# Altium project MSM8916_DRAM_PMIC_REF.PrjPcb (part 1 of 4)
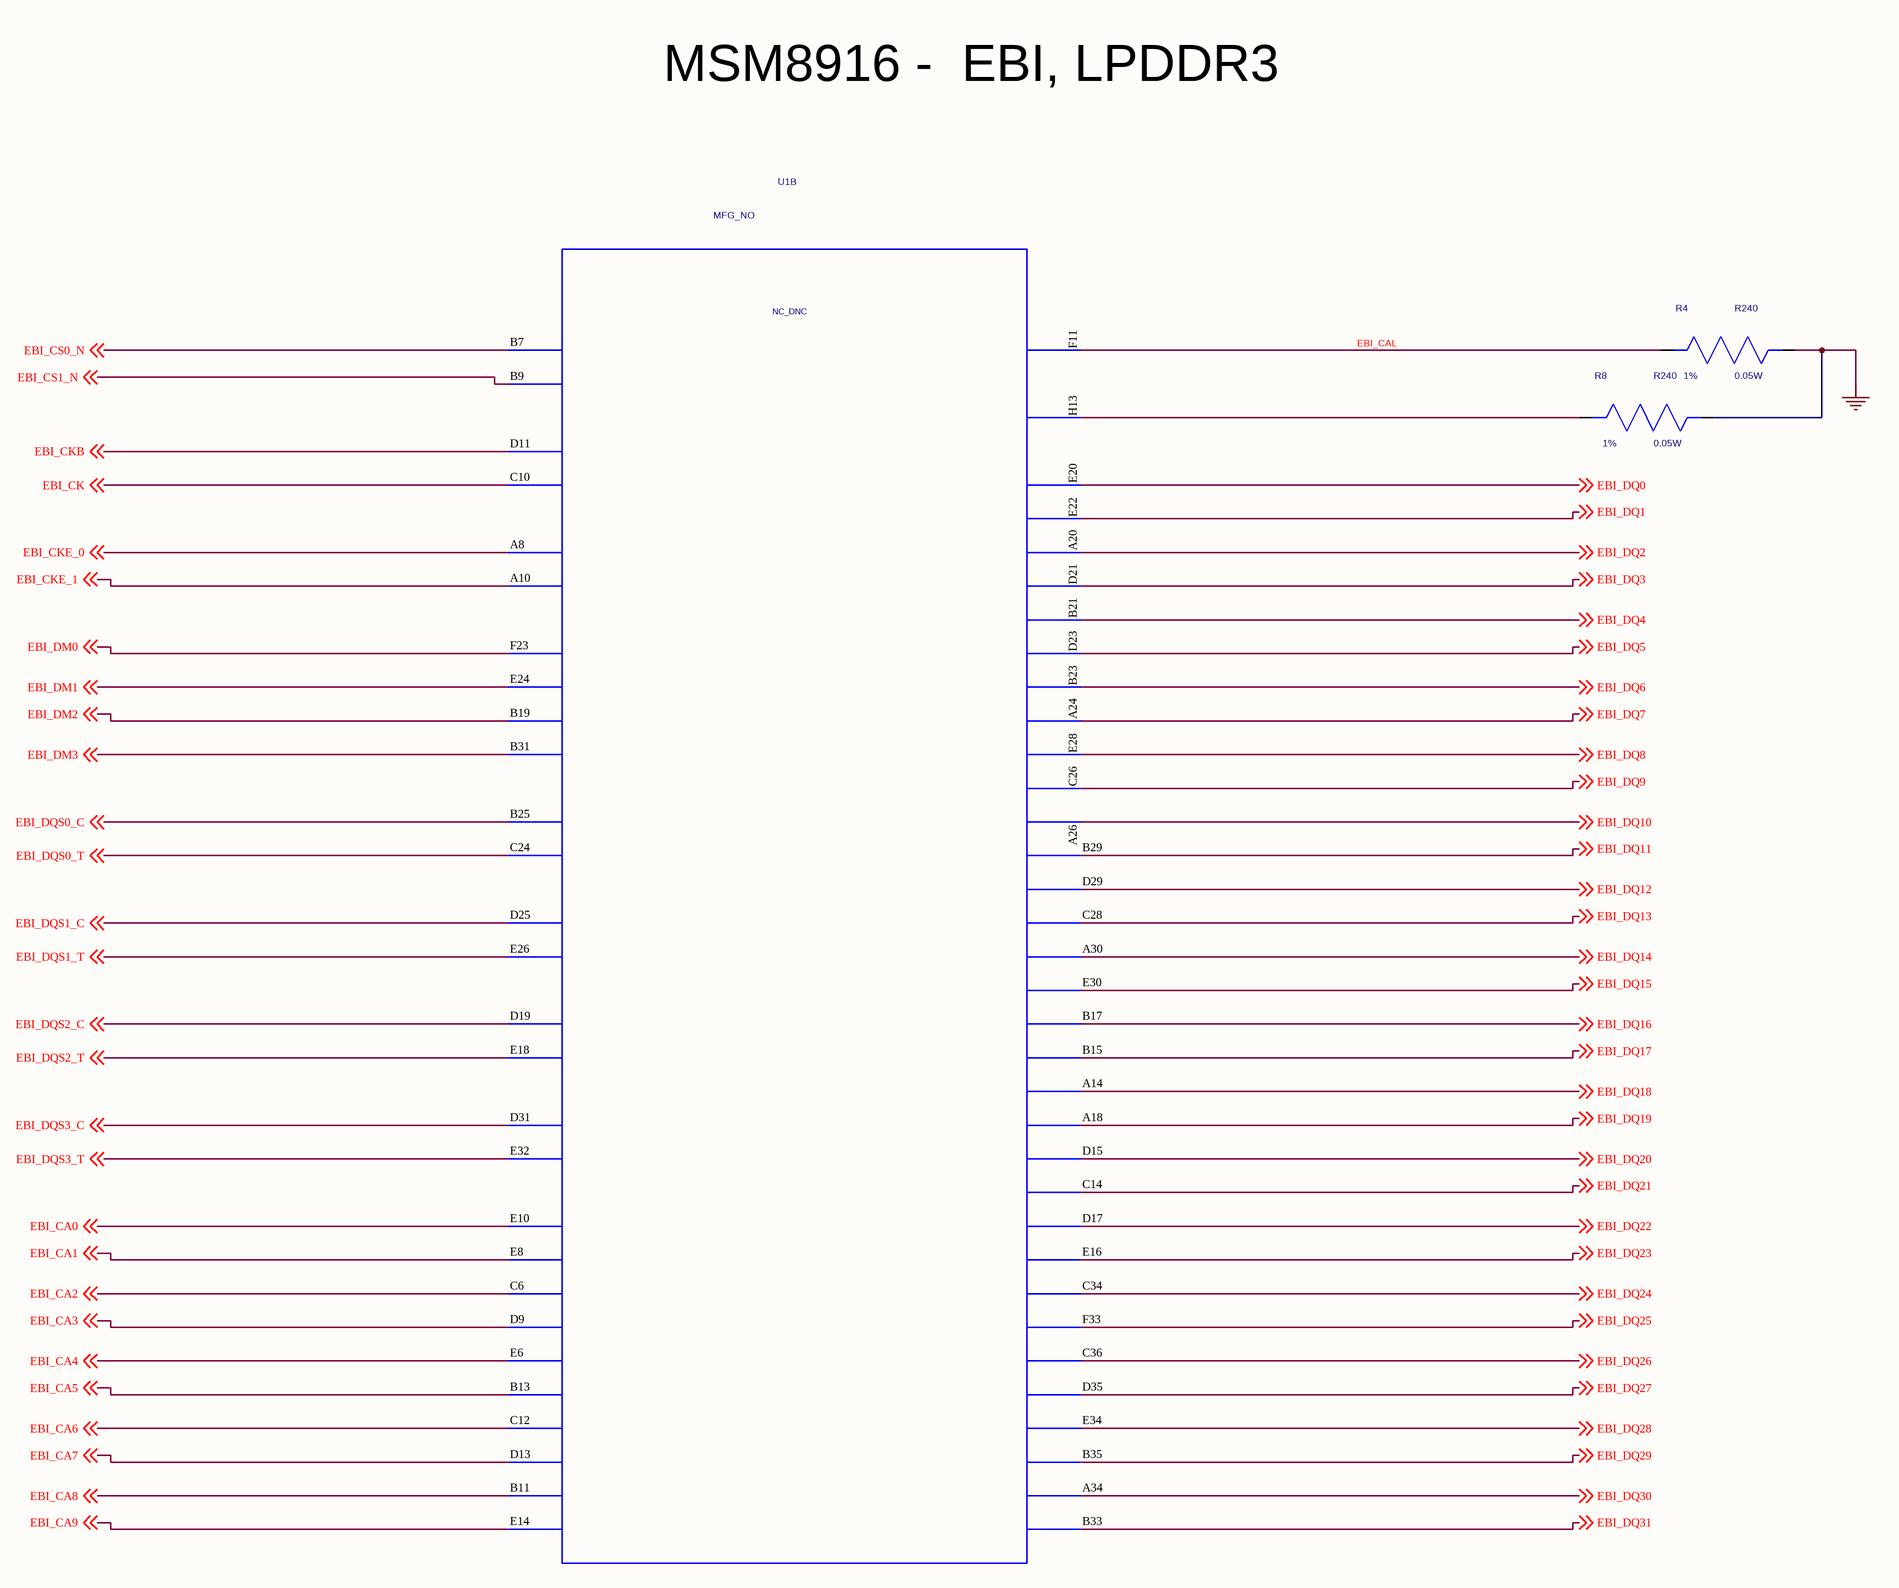
[diagram p0: 06_MSM8916_EBIO LPDDR3.SchDoc, top left]
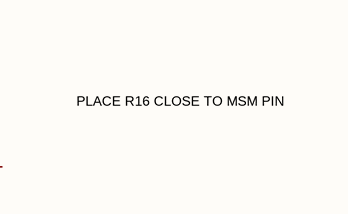
[diagram p1: 06_MSM8916_EBIO LPDDR3.SchDoc, top right]
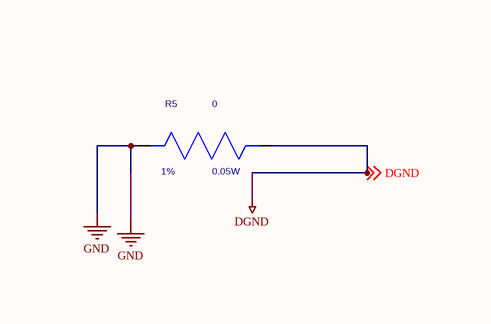
[diagram p2: 06_MSM8916_EBIO LPDDR3.SchDoc, bottom left]
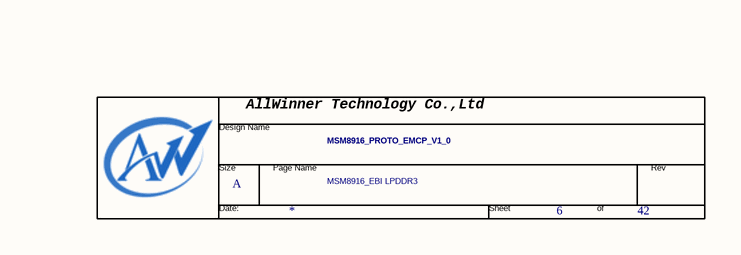
[diagram p3: 06_MSM8916_EBIO LPDDR3.SchDoc, bottom right]
17 sheets, 227 parts. Net scope: global (net labels, ports and power ports of the same name join across sheets).
Board file: MSM8916_board.PcbDoc
Sheets:
  06_MSM8916_EBIO LPDDR3.SchDoc
  05 MSM8916_CONTROL.SchDoc
  07_MSM8916_GPIO.SchDoc
  08_MSM8916_RF.SchDoc
  09_MSM8916_MIPI.SchDoc
  11 MSM8916_POWER2.SchDoc
  10 MSM8916_POWER1.SchDoc
  12 MSM8916_POWER3.SchDoc
  21 MEMORY_POWER.SchDoc
  14 PM8916_CONTROL CLOCK.SchDoc
  15 PM8916_CHARGING GPIO.SchDoc
  16 PM8916_SMPS.SchDoc
  17 PM8916_LDO.SchDoc
  20 MEMORY_CONTROL.SchDoc
  BYPASS_CAP.SchDoc
  SD Card_WCN_RF.SchDoc
  INTERFACE_PWR_LS_HS.SchDoc

## Sheet 06_MSM8916_EBIO LPDDR3.SchDoc
size 868 x 576 mm

### Parts
(Parts that share a designator on the sheet are numbered #1, #2 ... from top to bottom, then left to right.)
*#1  Page Count: 42  Page Number: 6  Page Size: A  Title: MSM8916_PROTO_EMCP_V1_0  Doc: MSM8916_EBI LPDDR3  (hidden comment: TitleBlock0-AW)  (graphical)
R4  R240  Tolerance: 1%  POWER: 0.05W  [c0402]
R5  0  Tolerance: 1%  POWER: 0.05W  [c0402]
R8  R240  Tolerance: 1%  POWER: 0.05W  [c0402]
U1  SYMNAME: NC_DNC  PART_ID: MFG_NO  [MSM-8916-0-760NSP-TR-00-0]  (hidden comment: ASIC_MSM8936_760PIN)  (part B of 13)

### Nets
DGND: R5.2(NEG) ; off-sheet DGND
GND: R4.2(NEG) R5.1(POS) R8.2(NEG)
EBI_CA0: U1.E10(EBI0_CA_0) ; off-sheet EBI_CA0
EBI_CA1: U1.E8(EBI0_CA_1) ; off-sheet EBI_CA1
EBI_CA2: U1.C6(EBI0_CA_2) ; off-sheet EBI_CA2
EBI_CA3: U1.D9(EBI0_CA_3) ; off-sheet EBI_CA3
EBI_CA4: U1.E6(EBI0_CA_4) ; off-sheet EBI_CA4
EBI_CA5: U1.B13(EBI0_CA_5) ; off-sheet EBI_CA5
EBI_CA6: U1.C12(EBI0_CA_6) ; off-sheet EBI_CA6
EBI_CA7: U1.D13(EBI0_CA_7) ; off-sheet EBI_CA7
EBI_CA8: U1.B11(EBI0_CA_8) ; off-sheet EBI_CA8
EBI_CA9: U1.E14(EBI0_CA_9) ; off-sheet EBI_CA9
EBI_CAL: R4.1(POS) U1.F11(EBI0_CAL)
EBI_CK: U1.C10(EBI0_CK) ; off-sheet EBI_CK
EBI_CKB: U1.D11(EBI0_CKB) ; off-sheet EBI_CKB
EBI_CKE_0: U1.A8(EBI0_CKE_0) ; off-sheet EBI_CKE_0
EBI_CKE_1: U1.A10(EBI0_CKE_1) ; off-sheet EBI_CKE_1
EBI_CS0_N: U1.B7(EBI0_CS_N_0) ; off-sheet EBI_CS0_N
EBI_CS1_N: U1.B9(EBI0_CS_N_1) ; off-sheet EBI_CS1_N
EBI_DM0: U1.F23(EBI0_DM_0) ; off-sheet EBI_DM0
EBI_DM1: U1.E24(EBI0_DM_1) ; off-sheet EBI_DM1
EBI_DM2: U1.B19(EBI0_DM_2) ; off-sheet EBI_DM2
EBI_DM3: U1.B31(EBI0_DM_3) ; off-sheet EBI_DM3
EBI_DQ0: U1.E20(EBI0_DQ_0) ; off-sheet EBI_DQ0
EBI_DQ1: U1.E22(EBI0_DQ_1) ; off-sheet EBI_DQ1
EBI_DQ2: U1.A20(EBI0_DQ_2) ; off-sheet EBI_DQ2
EBI_DQ3: U1.D21(EBI0_DQ_3) ; off-sheet EBI_DQ3
EBI_DQ4: U1.B21(EBI0_DQ_4) ; off-sheet EBI_DQ4
EBI_DQ5: U1.D23(EBI0_DQ_5) ; off-sheet EBI_DQ5
EBI_DQ6: U1.B23(EBI0_DQ_6) ; off-sheet EBI_DQ6
EBI_DQ7: U1.A24(EBI0_DQ_7) ; off-sheet EBI_DQ7
EBI_DQ8: U1.E28(EBI0_DQ_8) ; off-sheet EBI_DQ8
EBI_DQ9: U1.C26(EBI0_DQ_9) ; off-sheet EBI_DQ9
EBI_DQ10: U1.A26(EBI0_DQ_10) ; off-sheet EBI_DQ10
EBI_DQ11: U1.B29(EBI0_DQ_11) ; off-sheet EBI_DQ11
EBI_DQ12: U1.D29(EBI0_DQ_12) ; off-sheet EBI_DQ12
EBI_DQ13: U1.C28(EBI0_DQ_13) ; off-sheet EBI_DQ13
EBI_DQ14: U1.A30(EBI0_DQ_14) ; off-sheet EBI_DQ14
EBI_DQ15: U1.E30(EBI0_DQ_15) ; off-sheet EBI_DQ15
EBI_DQ16: U1.B17(EBI0_DQ_16) ; off-sheet EBI_DQ16
EBI_DQ17: U1.B15(EBI0_DQ_17) ; off-sheet EBI_DQ17
EBI_DQ18: U1.A14(EBI0_DQ_18) ; off-sheet EBI_DQ18
EBI_DQ19: U1.A18(EBI0_DQ_19) ; off-sheet EBI_DQ19
EBI_DQ20: U1.D15(EBI0_DQ_20) ; off-sheet EBI_DQ20
EBI_DQ21: U1.C14(EBI0_DQ_21) ; off-sheet EBI_DQ21
EBI_DQ22: U1.D17(EBI0_DQ_22) ; off-sheet EBI_DQ22
EBI_DQ23: U1.E16(EBI0_DQ_23) ; off-sheet EBI_DQ23
EBI_DQ24: U1.C34(EBI0_DQ_24) ; off-sheet EBI_DQ24
EBI_DQ25: U1.F33(EBI0_DQ_25) ; off-sheet EBI_DQ25
EBI_DQ26: U1.C36(EBI0_DQ_26) ; off-sheet EBI_DQ26
EBI_DQ27: U1.D35(EBI0_DQ_27) ; off-sheet EBI_DQ27
EBI_DQ28: U1.E34(EBI0_DQ_28) ; off-sheet EBI_DQ28
EBI_DQ29: U1.B35(EBI0_DQ_29) ; off-sheet EBI_DQ29
EBI_DQ30: U1.A34(EBI0_DQ_30) ; off-sheet EBI_DQ30
EBI_DQ31: U1.B33(EBI0_DQ_31) ; off-sheet EBI_DQ31
EBI_DQS0_C: U1.B25(EBI0_DQSB_0) ; off-sheet EBI_DQS0_C
EBI_DQS0_T: U1.C24(EBI0_DQS_0) ; off-sheet EBI_DQS0_T
EBI_DQS1_C: U1.D25(EBI0_DQSB_1) ; off-sheet EBI_DQS1_C
EBI_DQS1_T: U1.E26(EBI0_DQS_1) ; off-sheet EBI_DQS1_T
EBI_DQS2_C: U1.D19(EBI0_DQSB_2) ; off-sheet EBI_DQS2_C
EBI_DQS2_T: U1.E18(EBI0_DQS_2) ; off-sheet EBI_DQS2_T
EBI_DQS3_C: U1.D31(EBI0_DQSB_3) ; off-sheet EBI_DQS3_C
EBI_DQS3_T: U1.E32(EBI0_DQS_3) ; off-sheet EBI_DQS3_T
NetR8_1: R8.1(POS) U1.H13(EBI0_ODT)

### Notes on the sheet
- MSM8916 -  EBI, LPDDR3
- PLACE R16 CLOSE TO MSM PIN
- (in symbol TitleBlock0-AW) AllWinner Technology Co.,Ltd; Design Name; Size; Page Name; Rev; Date:; Sheet; of

### Library data of the parts
R4 R5 R8 = RESISTOR_Dup3: PART_NUMBER: MCN_NO; PART_ID: MFG_NO; OriginalSymbolOrigin: (-200,50); CDS_LMAN_SYM_OUTLINE: -150,50,150,-50; SYMNAME: resistor; PACK_TYPE: ?
U1 = ASIC_MSM8936_760PIN: PART_NUMBER: MCN_NO; OriginalSymbolOrigin: (-1100,2500); SPLIT_INST: TRUE; CDS_LMAN_SYM_OUTLINE: -1050,2500,1050,-2500; CDS_LMAN_SPLIT_NUMBER: 1 of 13; PACK_TYPE: ?
*#1 = TitleBlock0-AW: RevCode: ?; Page Create Date: March  8, 1995; Page Modify Date: *

## Sheet 05 MSM8916_CONTROL.SchDoc
size 868 x 576 mm
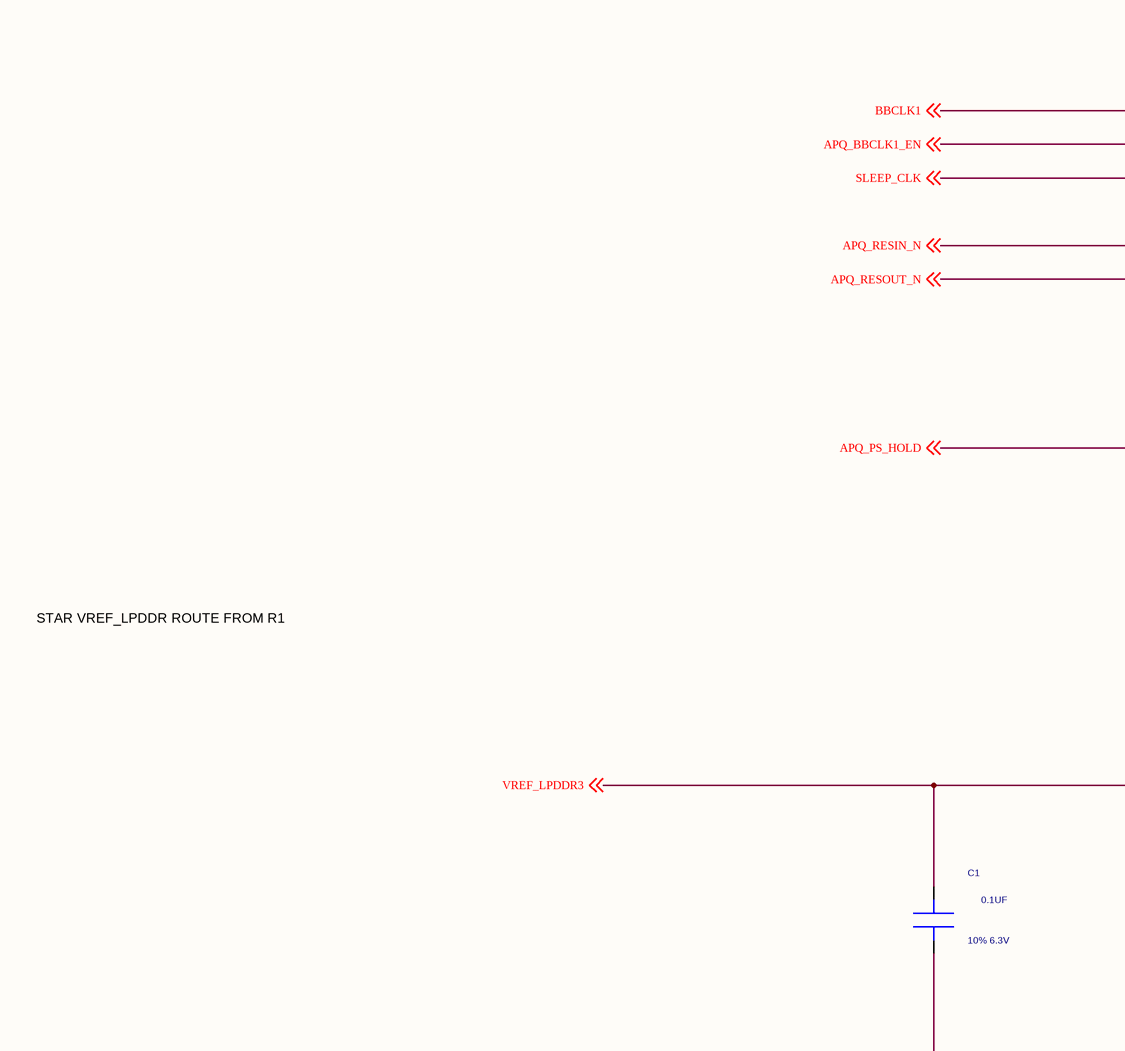
[diagram p4: 05 MSM8916_CONTROL.SchDoc, top left]
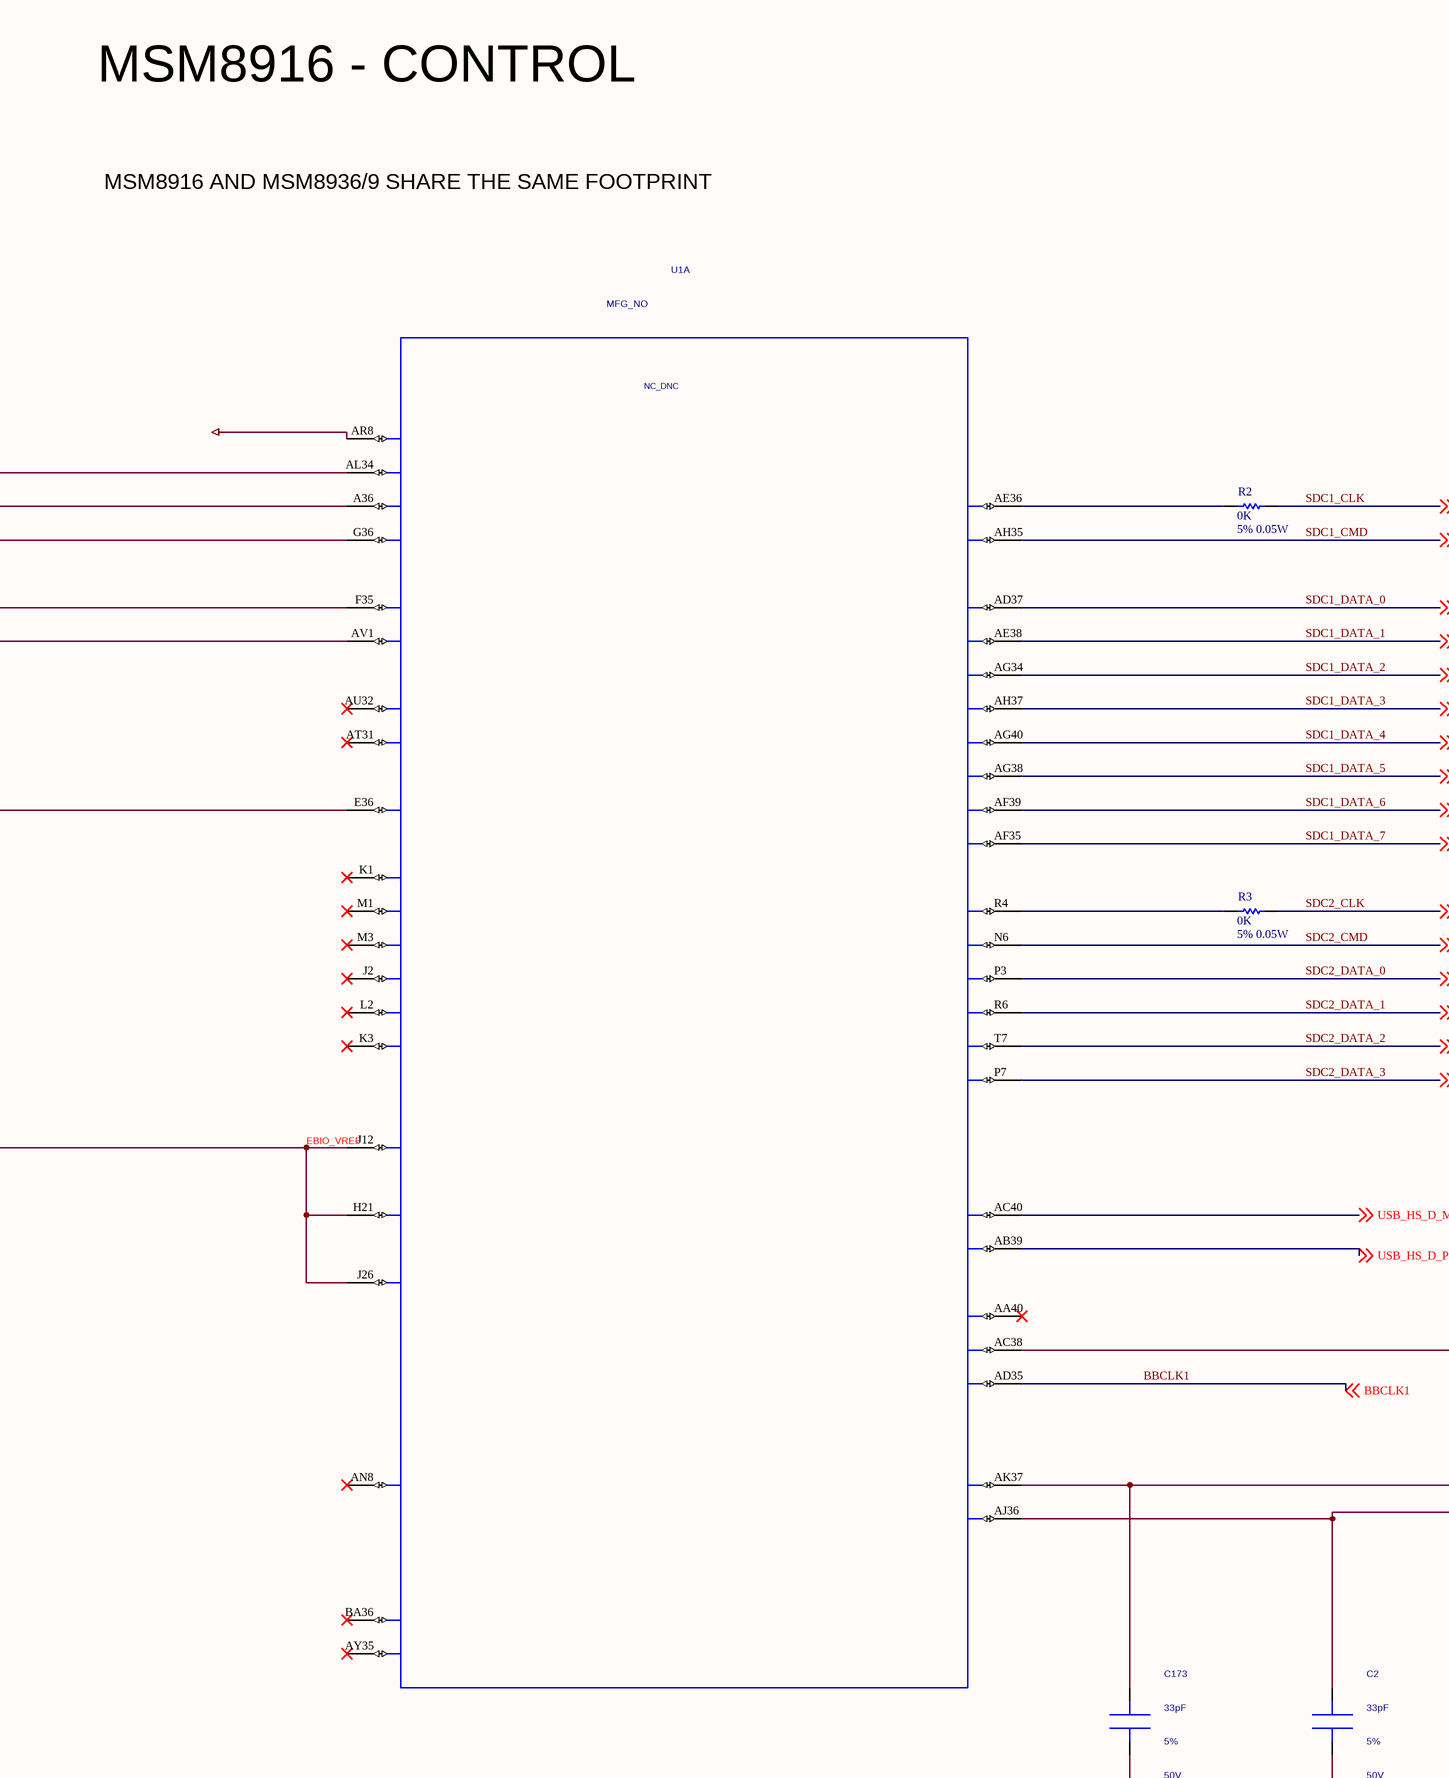
[diagram p5: 05 MSM8916_CONTROL.SchDoc, top middle]
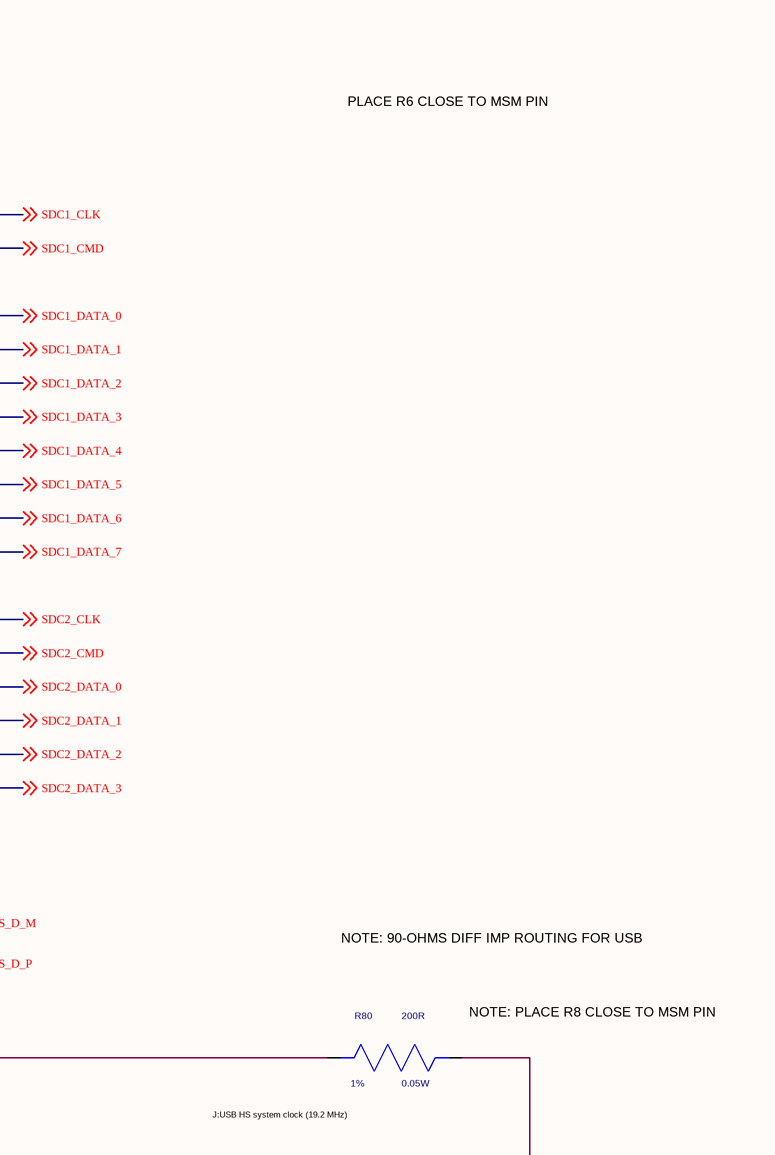
[diagram p6: 05 MSM8916_CONTROL.SchDoc, top right]
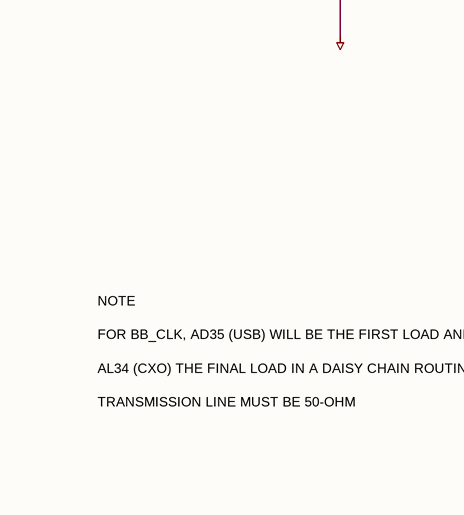
[diagram p7: 05 MSM8916_CONTROL.SchDoc, bottom left]
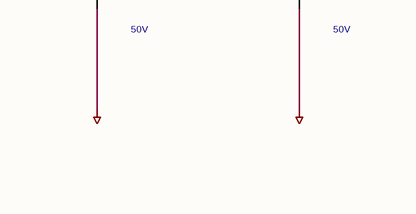
[diagram p8: 05 MSM8916_CONTROL.SchDoc, bottom middle]
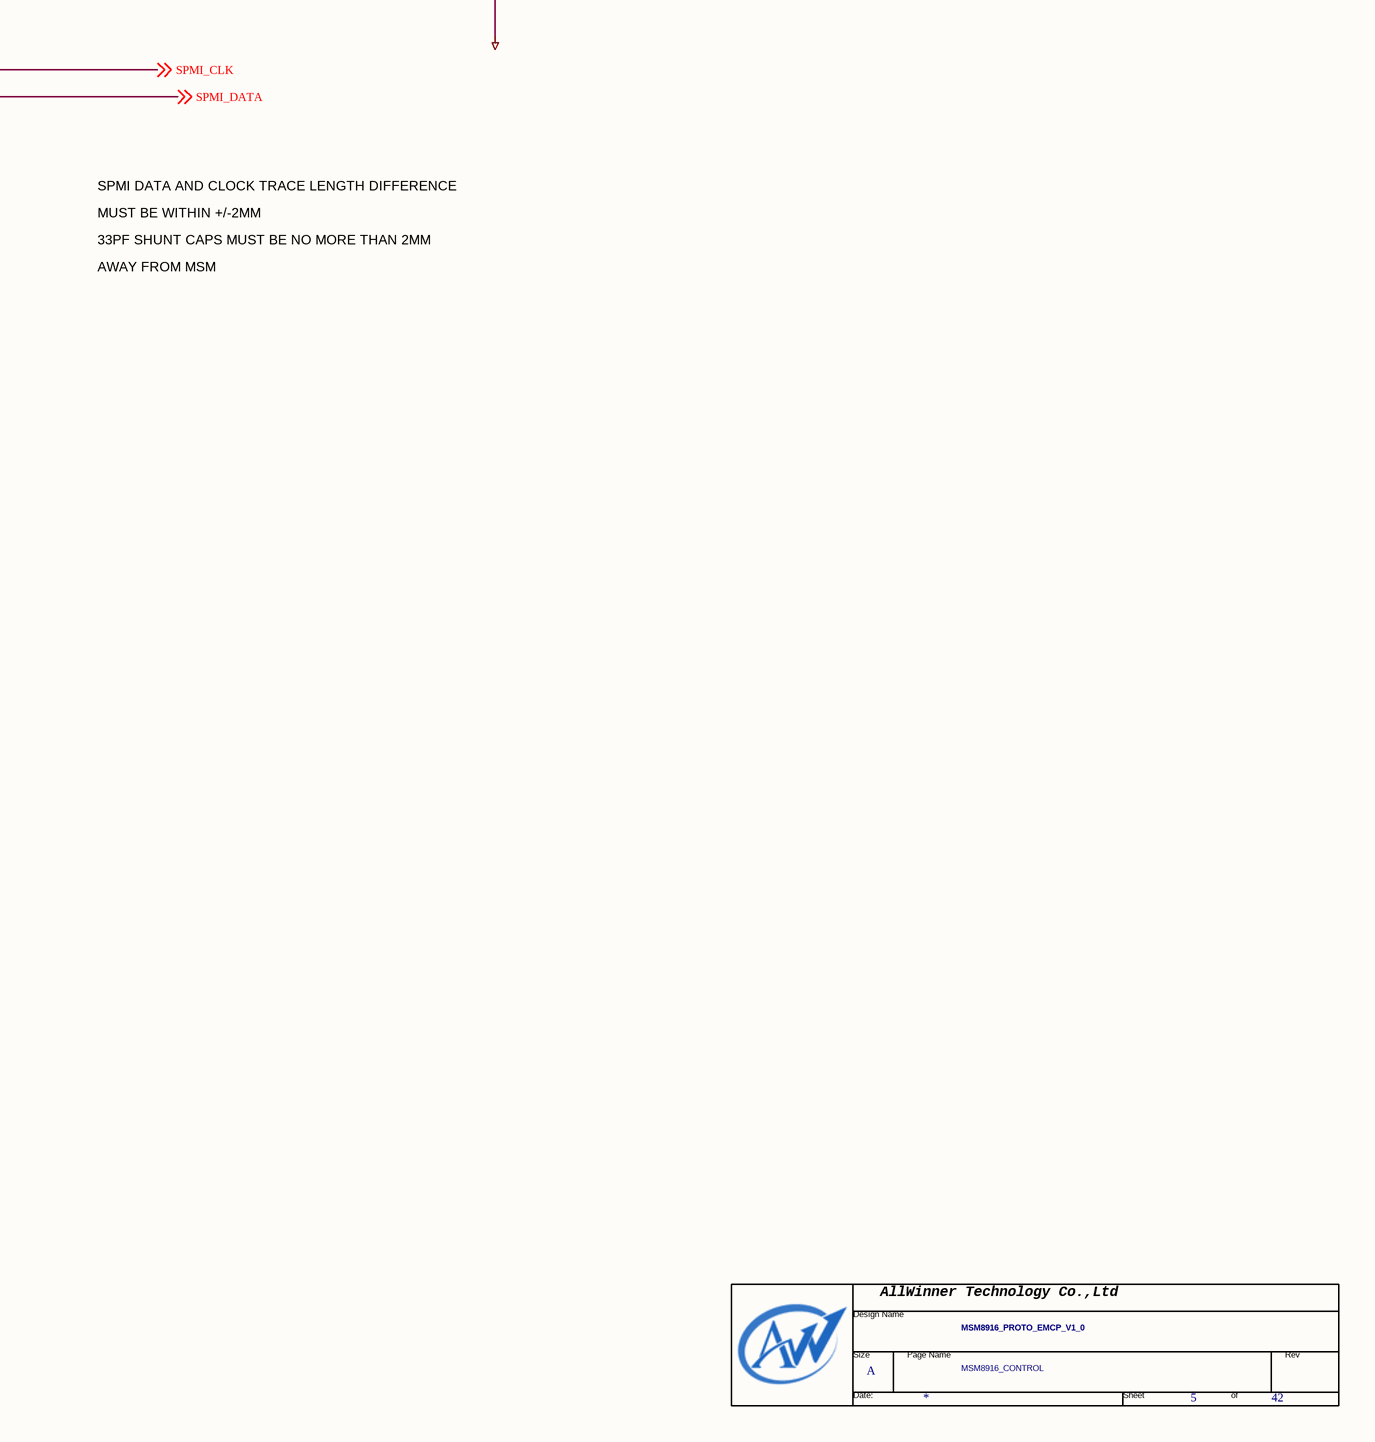
[diagram p9: 05 MSM8916_CONTROL.SchDoc, bottom right]

### Parts
(Parts that share a designator on the sheet are numbered #1, #2 ... from top to bottom, then left to right.)
*#2  Page Count: 42  Page Number: 5  Page Size: A  Title: MSM8916_PROTO_EMCP_V1_0  Doc: MSM8916_CONTROL  (hidden comment: TitleBlock0-AW)  (graphical)
C1  0.1UF  Tolerance: 10% 6.3V  [c0402]
C2  33pF  VOLT: 50V  Tolerance: 5%  [c0402]
C173  33pF  VOLT: 50V  Tolerance: 5%  [c0402]
R2  0K  value 5% 0.05W  [r0402]
R3  0K  value 5% 0.05W  [r0402]
R80  200R  Tolerance: 1%  POWER: 0.05W  [c0402]
U1  SYMNAME: NC_DNC  PART_ID: MFG_NO  [MSM-8916-0-760NSP-TR-00-0]  (hidden comment: ASIC_MSM8936_760PIN)  (part A of 13)

### Nets
DGND: C1.2(NEG) C2.2(NEG) C173.2(NEG) R80.2(NEG) U1.AR8(WCSS_XO)
APQ_BBCLK1_EN: U1.A36(CXO_EN) ; off-sheet APQ_BBCLK1_EN
APQ_PS_HOLD: U1.E36(PS_HOLD) ; off-sheet APQ_PS_HOLD
APQ_RESIN_N: U1.F35(RESIN*) ; off-sheet APQ_RESIN_N
APQ_RESOUT_N: U1.AV1(RESOUT*) ; off-sheet APQ_RESOUT_N
BBCLK1: U1.AD35(USB2_HS_SYSCLOCK) U1.AL34(CXO) ; off-sheet BBCLK1
EBIO_VREF: C1.1(POS) U1.H21(VREF_EBI0_D0_D2) U1.J12(VREF_EBI0_CA) U1.J26(VREF_EBI0_D1_D3) ; off-sheet VREF_LPDDR3  [also labelled VREF_LPDDR3]
SDC1_CLK: R2.2 ; off-sheet SDC1_CLK
SDC1_CMD: U1.AH35(SDC1_CMD) ; off-sheet SDC1_CMD
SDC1_DATA_0: U1.AD37(SDC1_DATA_0) ; off-sheet SDC1_DATA_0
SDC1_DATA_1: U1.AE38(SDC1_DATA_1) ; off-sheet SDC1_DATA_1
SDC1_DATA_2: U1.AG34(SDC1_DATA_2) ; off-sheet SDC1_DATA_2
SDC1_DATA_3: U1.AH37(SDC1_DATA_3) ; off-sheet SDC1_DATA_3
SDC1_DATA_4: U1.AG40(SDC1_DATA_4) ; off-sheet SDC1_DATA_4
SDC1_DATA_5: U1.AG38(SDC1_DATA_5) ; off-sheet SDC1_DATA_5
SDC1_DATA_6: U1.AF39(SDC1_DATA_6) ; off-sheet SDC1_DATA_6
SDC1_DATA_7: U1.AF35(SDC1_DATA_7) ; off-sheet SDC1_DATA_7
SDC2_CLK: R3.2 ; off-sheet SDC2_CLK
SDC2_CMD: U1.N6(SDC2_CMD) ; off-sheet SDC2_CMD
SDC2_DATA_0: U1.P3(SDC2_DATA_0) ; off-sheet SDC2_DATA_0
SDC2_DATA_1: U1.R6(SDC2_DATA_1) ; off-sheet SDC2_DATA_1
SDC2_DATA_2: U1.T7(SDC2_DATA_2) ; off-sheet SDC2_DATA_2
SDC2_DATA_3: U1.P7(SDC2_DATA_3) ; off-sheet SDC2_DATA_3
SLEEP_CLK: U1.G36(SLEEP_CLK) ; off-sheet SLEEP_CLK
SPMI_CLK: C173.1(POS) U1.AK37(PMIC_SPMI_CLK) ; off-sheet SPMI_CLK
SPMI_DATA: C2.1(POS) U1.AJ36(PMIC_SPMI_DATA) ; off-sheet SPMI_DATA
USB_HS_D_M: U1.AC40(USB2_HS_DM) ; off-sheet USB_HS_D_M
USB_HS_D_P: U1.AB39(USB2_HS_DP) ; off-sheet USB_HS_D_P
NetR2_1: R2.1 U1.AE36(SDC1_CLK)
NetR3_1: R3.1 U1.R4(SDC2_CLK)
NetR80_1: R80.1(POS) U1.AC38(USB2_HS_TXRTUNE)

Not connected (* = marked no-connect by the designer): U1 AA40(USB2_HS_ID)* AN8(PLL_TEST_SE)* AT31(MODE_1)* AU32(MODE_0)* AY35(ATEST1)* BA36(ATEST0)* J2(TDO)* K1(SRST*)* K3(TRST*)* L2(TMS)* M1(TCK)* M3(TDI)*

### Notes on the sheet
- MSM8916 - CONTROL
- MSM8916 AND MSM8936/9 SHARE THE SAME FOOTPRINT
- PLACE R6 CLOSE TO MSM PIN
- STAR VREF_LPDDR ROUTE FROM R1
- NOTE: 90-OHMS DIFF IMP ROUTING FOR USB
- (near R80) NOTE: PLACE R8 CLOSE TO MSM PIN
- J:USB HS system clock (19.2 MHz)
- SPMI DATA AND CLOCK TRACE LENGTH DIFFERENCE
- MUST BE WITHIN +/-2MM
- 33PF SHUNT CAPS MUST BE NO MORE THAN 2MM
- AWAY FROM MSM
- FOR BB_CLK, AD35 (USB) WILL BE THE FIRST LOAD AND
- NOTE
- AL34 (CXO) THE FINAL LOAD IN A DAISY CHAIN ROUTING
- TRANSMISSION LINE MUST BE 50-OHM
- (in symbol TitleBlock0-AW) AllWinner Technology Co.,Ltd; Design Name; Size; Page Name; Rev; Date:; Sheet; of

### Library data of the parts
C1 = CAP: PART_NUMBER: MCN_NO; PART_ID: MFG_NO; OriginalSymbolOrigin: (-100,75); VOLT: ?V; CDS_LMAN_SYM_OUTLINE: -75,25,75,-25; SYMNAME: CAP; PACK_TYPE: ?
C2 C173 = CAP: PART_NUMBER: MCN_NO; PART_ID: MFG_NO; OriginalSymbolOrigin: (-100,75); CDS_LMAN_SYM_OUTLINE: -75,25,75,-25; SYMNAME: CAP; PACK_TYPE: ?
R2 R3 = Res1: Resistor; Published: 8-Jun-2000; LatestRevisionDate: 17-Jul-2002; LatestRevisionNote: Re-released for DXP Platform.; PackageReference: AXIAL-0.3; Publisher: Altium Limited; PackageDescription: Axial Device, Thru-Hole; 2 Leads; 0.3 in Pin Spacing
R80 = RESISTOR_Dup3: as R4 on sheet 06_MSM8916_EBIO LPDDR3; SYMNAME: resistor; PACK_TYPE: ?
U1 = ASIC_MSM8936_760PIN: as U1 on sheet 06_MSM8916_EBIO LPDDR3; PACK_TYPE: ?
*#2 = TitleBlock0-AW: RevCode: ?; Page Create Date: March  8, 1995; Page Modify Date: *

## Sheet 07_MSM8916_GPIO.SchDoc
size A0
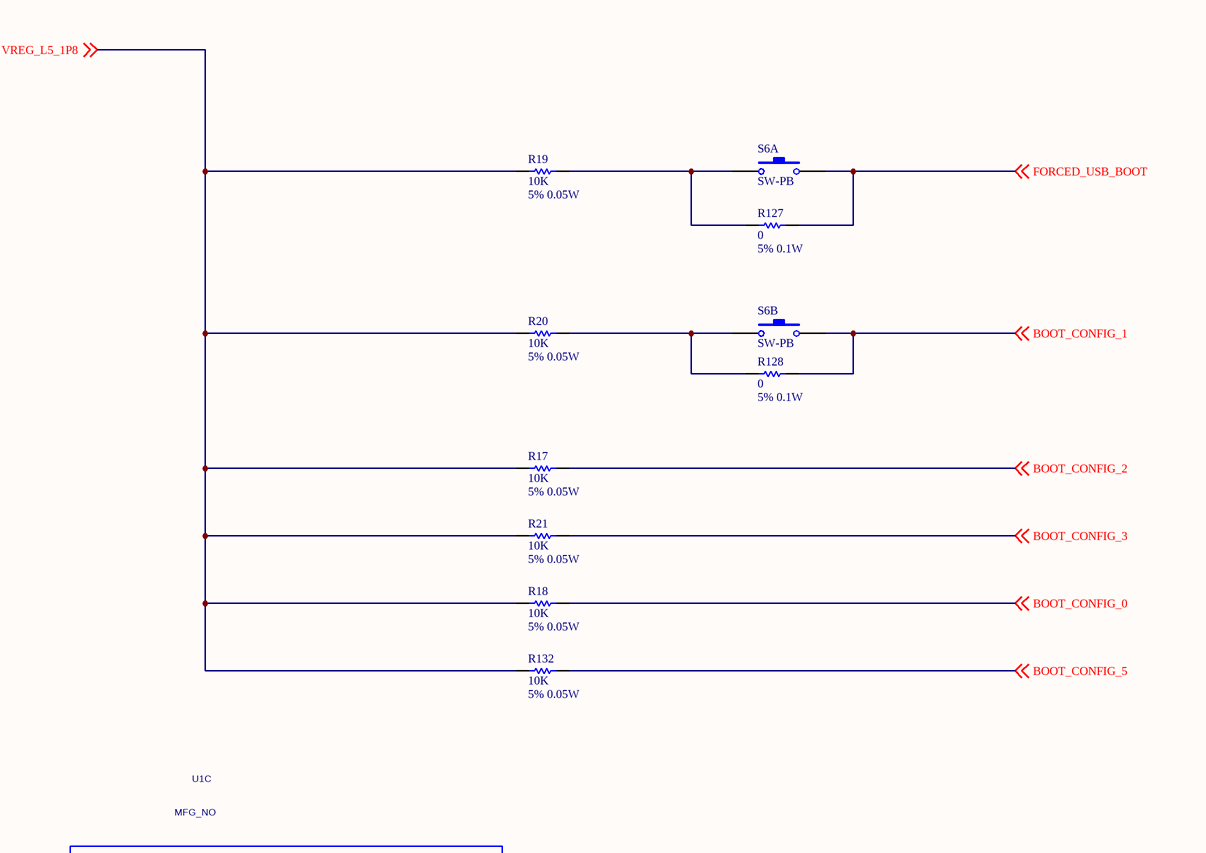
[diagram p10: 07_MSM8916_GPIO.SchDoc, top left]
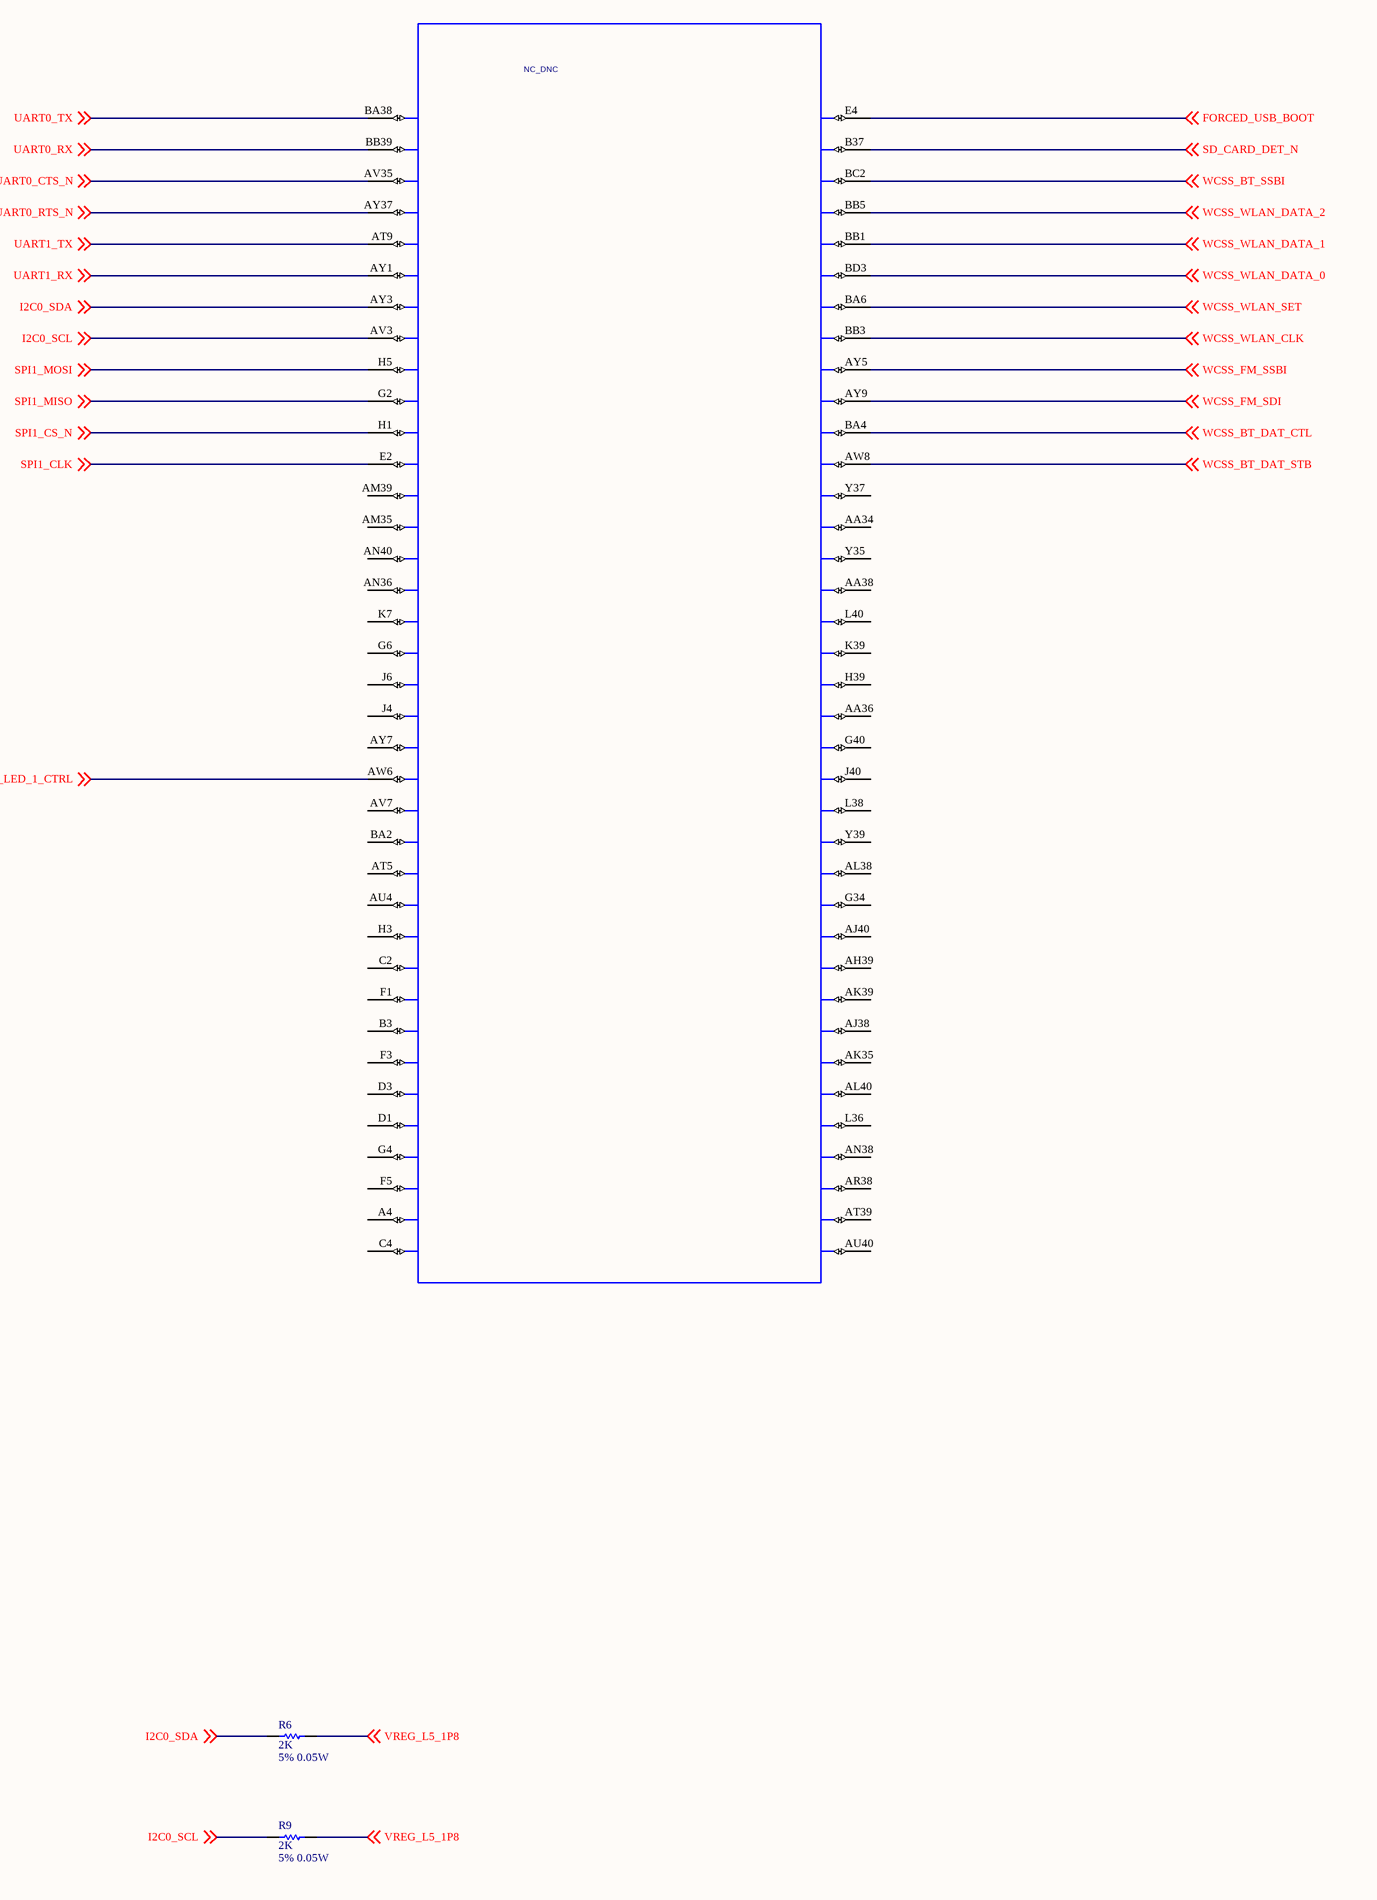
[diagram p11: 07_MSM8916_GPIO.SchDoc, bottom left]
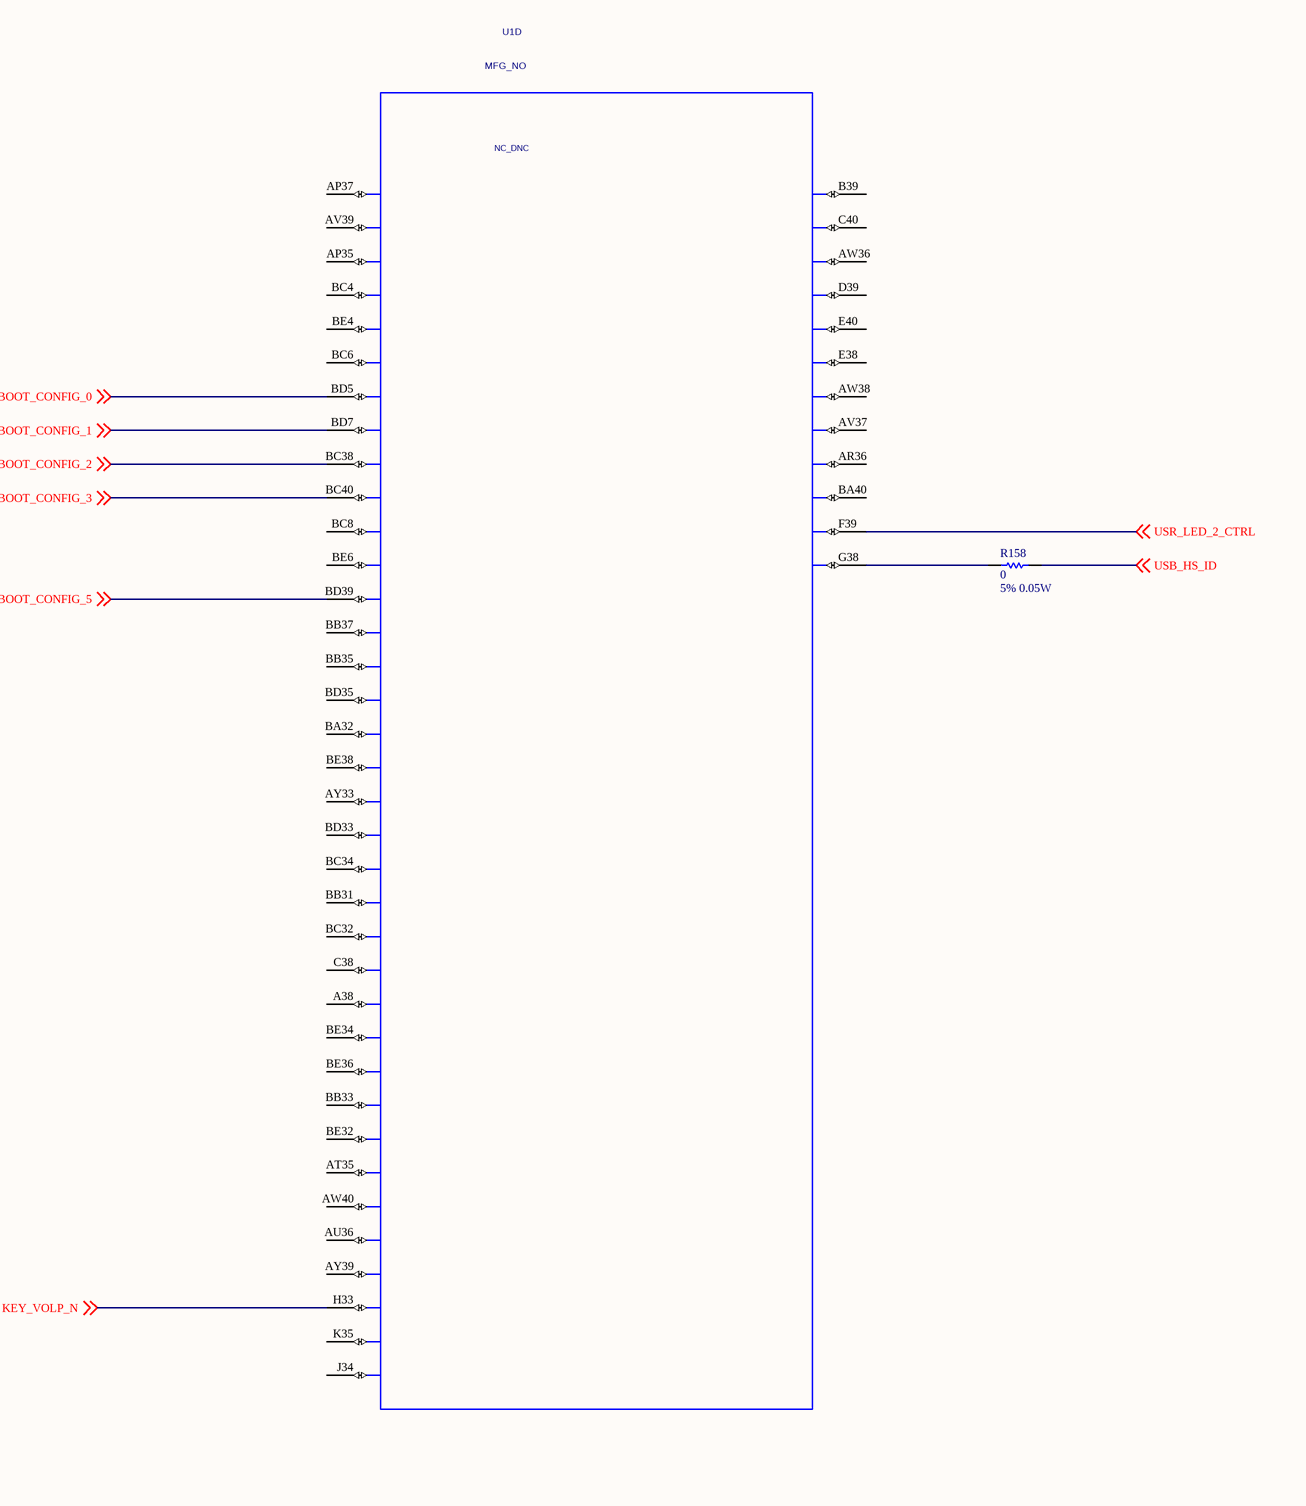
[diagram p12: 07_MSM8916_GPIO.SchDoc, bottom right]

### Parts
R6  2K  value 5% 0.05W  [r0402]
R9  2K  value 5% 0.05W  [r0402]
R17  10K  value 5% 0.05W  [r0402]
R18  10K  value 5% 0.05W  [r0402]
R19  10K  value 5% 0.05W  [r0402]
R20  10K  value 5% 0.05W  [r0402]
R21  10K  value 5% 0.05W  [r0402]
R127  0  value 5% 0.1W  [r0402]
R128  0  value 5% 0.1W  [r0402]
R132  10K  value 5% 0.05W  [r0402]
R158  0  value 5% 0.05W  [r0402]
S6A  SW-PB  [SPST-2]
S6B  SW-PB  [SPST-2]
U1  SYMNAME: NC_DNC  PART_ID: MFG_NO  [MSM-8916-0-760NSP-TR-00-0]  (hidden comment: ASIC_MSM8936_760PIN)  (parts C,D of 13)

### Nets
VREG_L5_1P8: R6.1 R9.1 R17.1 R18.1 R19.1 R20.1 R21.1 R132.1 ; off-sheet VREG_L5_1P8
BOOT_CONFIG_0: R18.2 U1.BD5(GPIO_80) ; off-sheet BOOT_CONFIG_0
BOOT_CONFIG_1: R128.2 S6B.2 U1.BD7(GPIO_81) ; off-sheet BOOT_CONFIG_1
BOOT_CONFIG_2: R17.2 U1.BC38(GPIO_82) ; off-sheet BOOT_CONFIG_2
BOOT_CONFIG_3: R21.2 U1.BC40(GPIO_83) ; off-sheet BOOT_CONFIG_3
BOOT_CONFIG_5: R132.2 U1.BD39(GPIO_86) ; off-sheet BOOT_CONFIG_5
FORCED_USB_BOOT: R127.2 S6A.2 U1.E4(GPIO_37) ; off-sheet FORCED_USB_BOOT
I2C0_SCL: R9.2 U1.AV3(GPIO_7) ; off-sheet I2C0_SCL
I2C0_SDA: R6.2 U1.AY3(GPIO_6) ; off-sheet I2C0_SDA
KEY_VOLP_N: U1.H33(GPIO_107) ; off-sheet KEY_VOLP_N
SD_CARD_DET_N: U1.B37(GPIO_38) ; off-sheet SD_CARD_DET_N
SPI1_CLK: U1.E2(GPIO_11) ; off-sheet SPI1_CLK
SPI1_CS_N: U1.H1(GPIO_10) ; off-sheet SPI1_CS_N
SPI1_MISO: U1.G2(GPIO_9) ; off-sheet SPI1_MISO
SPI1_MOSI: U1.H5(GPIO_8) ; off-sheet SPI1_MOSI
UART0_CTS_N: U1.AV35(GPIO_2) ; off-sheet UART0_CTS_N
UART0_RTS_N: U1.AY37(GPIO_3) ; off-sheet UART0_RTS_N
UART0_RX: U1.BB39(GPIO_1) ; off-sheet UART0_RX
UART0_TX: U1.BA38(GPIO_0) ; off-sheet UART0_TX
UART1_RX: U1.AY1(GPIO_5) ; off-sheet UART1_RX
UART1_TX: U1.AT9(GPIO_4) ; off-sheet UART1_TX
USB_HS_ID: R158.2 ; off-sheet USB_HS_ID
USR_LED_1_CTRL: U1.AW6(GPIO_21) ; off-sheet USR_LED_1_CTRL
USR_LED_2_CTRL: U1.F39(GPIO_120) ; off-sheet USR_LED_2_CTRL
WCSS_BT_DAT_CTL: U1.BA4(GPIO_47) ; off-sheet WCSS_BT_DAT_CTL
WCSS_BT_DAT_STB: U1.AW8(GPIO_48) ; off-sheet WCSS_BT_DAT_STB
WCSS_BT_SSBI: U1.BC2(GPIO_39) ; off-sheet WCSS_BT_SSBI
WCSS_FM_SDI: U1.AY9(GPIO_46) ; off-sheet WCSS_FM_SDI
WCSS_FM_SSBI: U1.AY5(GPIO_45) ; off-sheet WCSS_FM_SSBI
WCSS_WLAN_CLK: U1.BB3(GPIO_44) ; off-sheet WCSS_WLAN_CLK
WCSS_WLAN_DATA_0: U1.BD3(GPIO_42) ; off-sheet WCSS_WLAN_DATA_0
WCSS_WLAN_DATA_1: U1.BB1(GPIO_41) ; off-sheet WCSS_WLAN_DATA_1
WCSS_WLAN_DATA_2: U1.BB5(GPIO_40) ; off-sheet WCSS_WLAN_DATA_2
WCSS_WLAN_SET: U1.BA6(GPIO_43) ; off-sheet WCSS_WLAN_SET
NetR19_2: R19.2 R127.1 S6A.1
NetR20_2: R20.2 R128.1 S6B.1
NetR158_1: R158.1 U1.G38(GPIO_121)

Not connected (* = marked no-connect by the designer): U1 A4(GPIO_35) A38(GPIO_98) AA34(GPIO_50) AA36(GPIO_56) AA38(GPIO_52) AH39(GPIO_64) AJ38(GPIO_66) AJ40(GPIO_63) AK35(GPIO_67) AK39(GPIO_65) AL38(GPIO_61) AL40(GPIO_68) AM35(GPIO_13) AM39(GPIO_12) AN36(GPIO_15) AN38(GPIO_70) AN40(GPIO_14) AP35(GPIO_76) AP37(GPIO_74) AR36(GPIO_118) AR38(GPIO_71) AT5(GPIO_24) AT35(GPIO_103) AT39(GPIO_72) AU4(GPIO_25) AU36(GPIO_105) AU40(GPIO_73) AV7(GPIO_22) AV37(GPIO_117) AV39(GPIO_75) AW36(GPIO_112) AW38(GPIO_116) AW40(GPIO_104) AY7(GPIO_20) AY33(GPIO_92) AY39(GPIO_106) B3(GPIO_29) B39(GPIO_110) BA2(GPIO_23) BA32(GPIO_90) BA40(GPIO_119) BB31(GPIO_95) BB33(GPIO_101) BB35(GPIO_88) BB37(GPIO_87) BC4(GPIO_77) BC6(GPIO_79) BC8(GPIO_84) BC32(GPIO_96) BC34(GPIO_94) BD33(GPIO_93) BD35(GPIO_89) BE4(GPIO_78) BE6(GPIO_85) BE32(GPIO_102) BE34(GPIO_99) BE36(GPIO_100) BE38(GPIO_91) C2(GPIO_27) C4(GPIO_36) C38(GPIO_97) C40(GPIO_111) D1(GPIO_32) D3(GPIO_31) D39(GPIO_113) E38(GPIO_115) E40(GPIO_114) F1(GPIO_28) F3(GPIO_30) F5(GPIO_34) G4(GPIO_33) G6(GPIO_17) G34(GPIO_62) G40(GPIO_57) H3(GPIO_26) H39(GPIO_55) J4(GPIO_19) J6(GPIO_18) J34(GPIO_109) J40(GPIO_58) K7(GPIO_16) K35(GPIO_108) K39(GPIO_54) L36(GPIO_69) L38(GPIO_59) L40(GPIO_53) Y35(GPIO_51) Y37(GPIO_49) Y39(GPIO_60)

### Library data of the parts
R6 R9 R17-R21 R127 R128 R132 R158 = Res1: Resistor; Published: 8-Jun-2000; LatestRevisionDate: 17-Jul-2002; LatestRevisionNote: Re-released for DXP Platform.; PackageReference: AXIAL-0.3; Publisher: Altium Limited; PackageDescription: Axial Device, Thru-Hole; 2 Leads; 0.3 in Pin Spacing
S6A S6B = SW-PB: Switch; Published: 24-Mar-1999; LatestRevisionDate: 17-Jul-2002; LatestRevisionNote: Re-released for DXP Platform.; PackageReference: SPST-2; Publisher: Altium Limited; PackageDescription: Switch; 2 Leads
U1 = ASIC_MSM8936_760PIN: as U1 on sheet 06_MSM8916_EBIO LPDDR3; PACK_TYPE: ?

## Sheet 08_MSM8916_RF.SchDoc
size A0
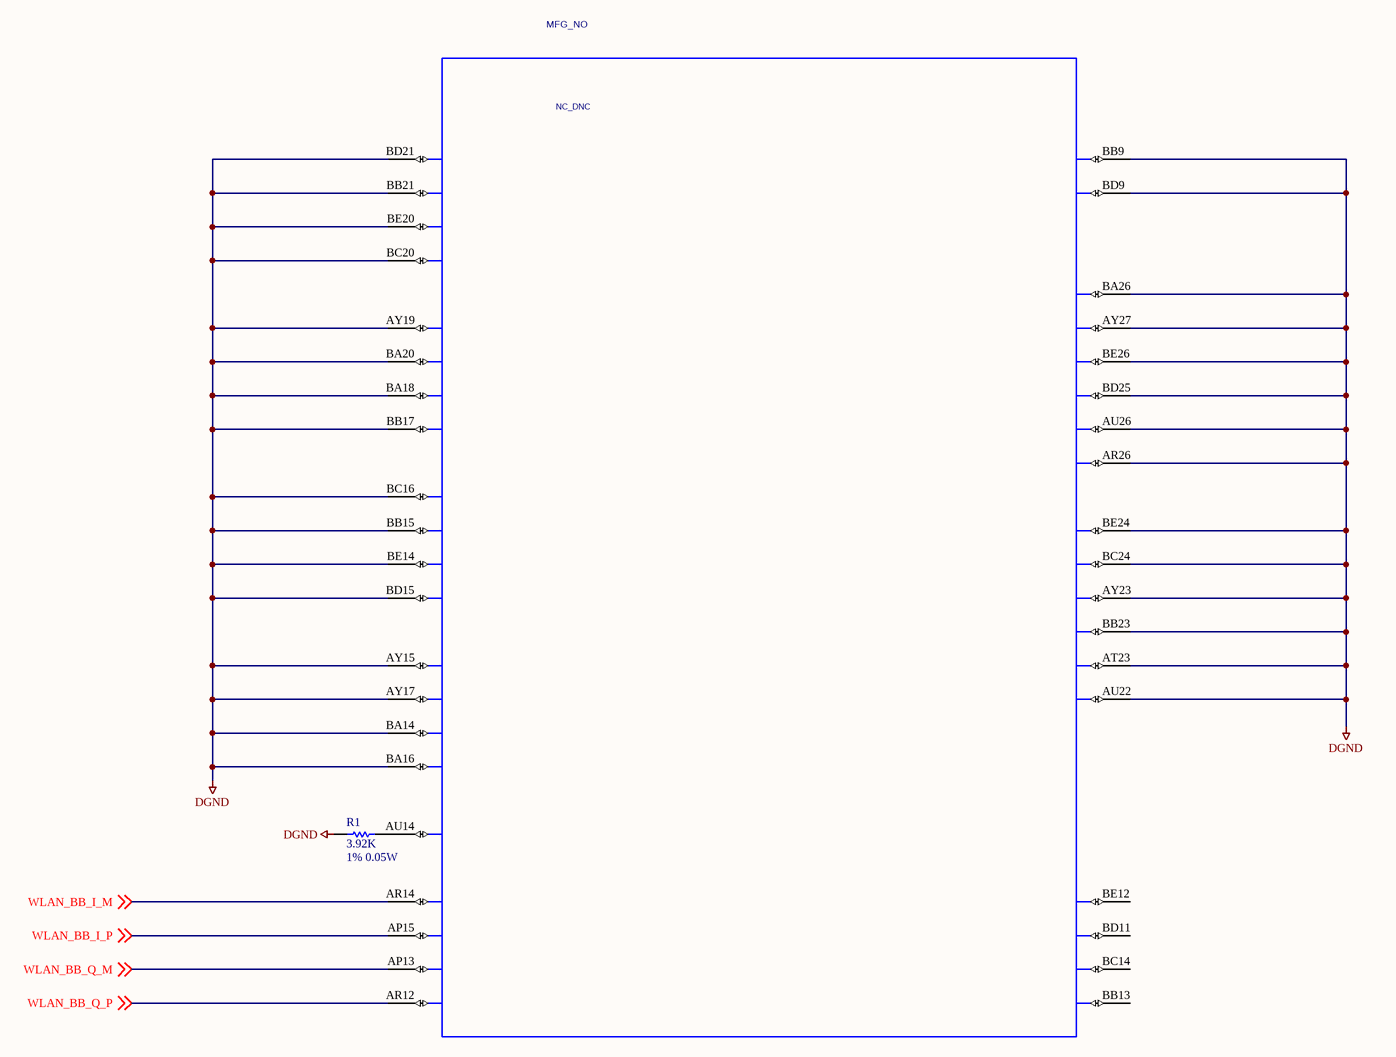
[diagram p13: 08_MSM8916_RF.SchDoc]

### Parts
R1  3.92K  value 1% 0.05W  [r0402]
U1  SYMNAME: NC_DNC  PART_ID: MFG_NO  [MSM-8916-0-760NSP-TR-00-0]  (hidden comment: ASIC_MSM8936_760PIN)  (part F of 13)

### Nets
DGND: R1.1 U1.AR26(TXDAC0_VREF) U1.AT23(TXDAC1_IREF) U1.AU22(TXDAC1_VREF) U1.AU26(TXDAC0_IREF) U1.AY15(BBRX1) U1.AY17(BBRX2) U1.AY19(BBRX_I_IN_CH1) U1.AY23(TXDAC1_QM) U1.AY27(TXDAC0_IP) U1.BA14(BBRX3) U1.BA16(BBRX4) U1.BA18(BBRX_I_QN_CH1) U1.BA20(BBRX_I_IP_CH1) U1.BA26(TXDAC0_IM) U1.BB9(GRFC1) U1.BB15(BBRX_I_IP_CH2) U1.BB17(BBRX_I_QP_CH1) U1.BB21(BBRX_I_IP_CH0) U1.BB23(TXDAC1_QP) U1.BC16(BBRX_I_IN_CH2) U1.BC20(BBRX_I_QP_CH0) U1.BC24(TXDAC1_IP) U1.BD9(GRFC2) U1.BD15(BBRX_I_QP_CH2) U1.BD21(BBRX_I_IN_CH0) U1.BD25(TXDAC0_QP) U1.BE14(BBRX_I_QN_CH2) U1.BE20(BBRX_I_QN_CH0) U1.BE24(TXDAC1_IM) U1.BE26(TXDAC0_QM)
WLAN_BB_I_M: U1.AR14(WLAN_IN) ; off-sheet WLAN_BB_I_M
WLAN_BB_I_P: U1.AP15(WLAN_IP) ; off-sheet WLAN_BB_I_P
WLAN_BB_Q_M: U1.AP13(WLAN_QN) ; off-sheet WLAN_BB_Q_M
WLAN_BB_Q_P: U1.AR12(WLAN_QP) ; off-sheet WLAN_BB_Q_P
NetR1_2: R1.2 U1.AU14(WLAN_RSET)

Not connected (* = marked no-connect by the designer): U1 BB13(GPS_BBQ2) BC14(GPS_BBQ) BD11(GPS_BBI2) BE12(GPS_BBI)

### Library data of the parts
R1 = Res1: Resistor; Published: 8-Jun-2000; LatestRevisionDate: 17-Jul-2002; LatestRevisionNote: Re-released for DXP Platform.; PackageReference: AXIAL-0.3; Publisher: Altium Limited; PackageDescription: Axial Device, Thru-Hole; 2 Leads; 0.3 in Pin Spacing
U1 = ASIC_MSM8936_760PIN: as U1 on sheet 06_MSM8916_EBIO LPDDR3; PACK_TYPE: ?

## Sheet 09_MSM8916_MIPI.SchDoc
size A4
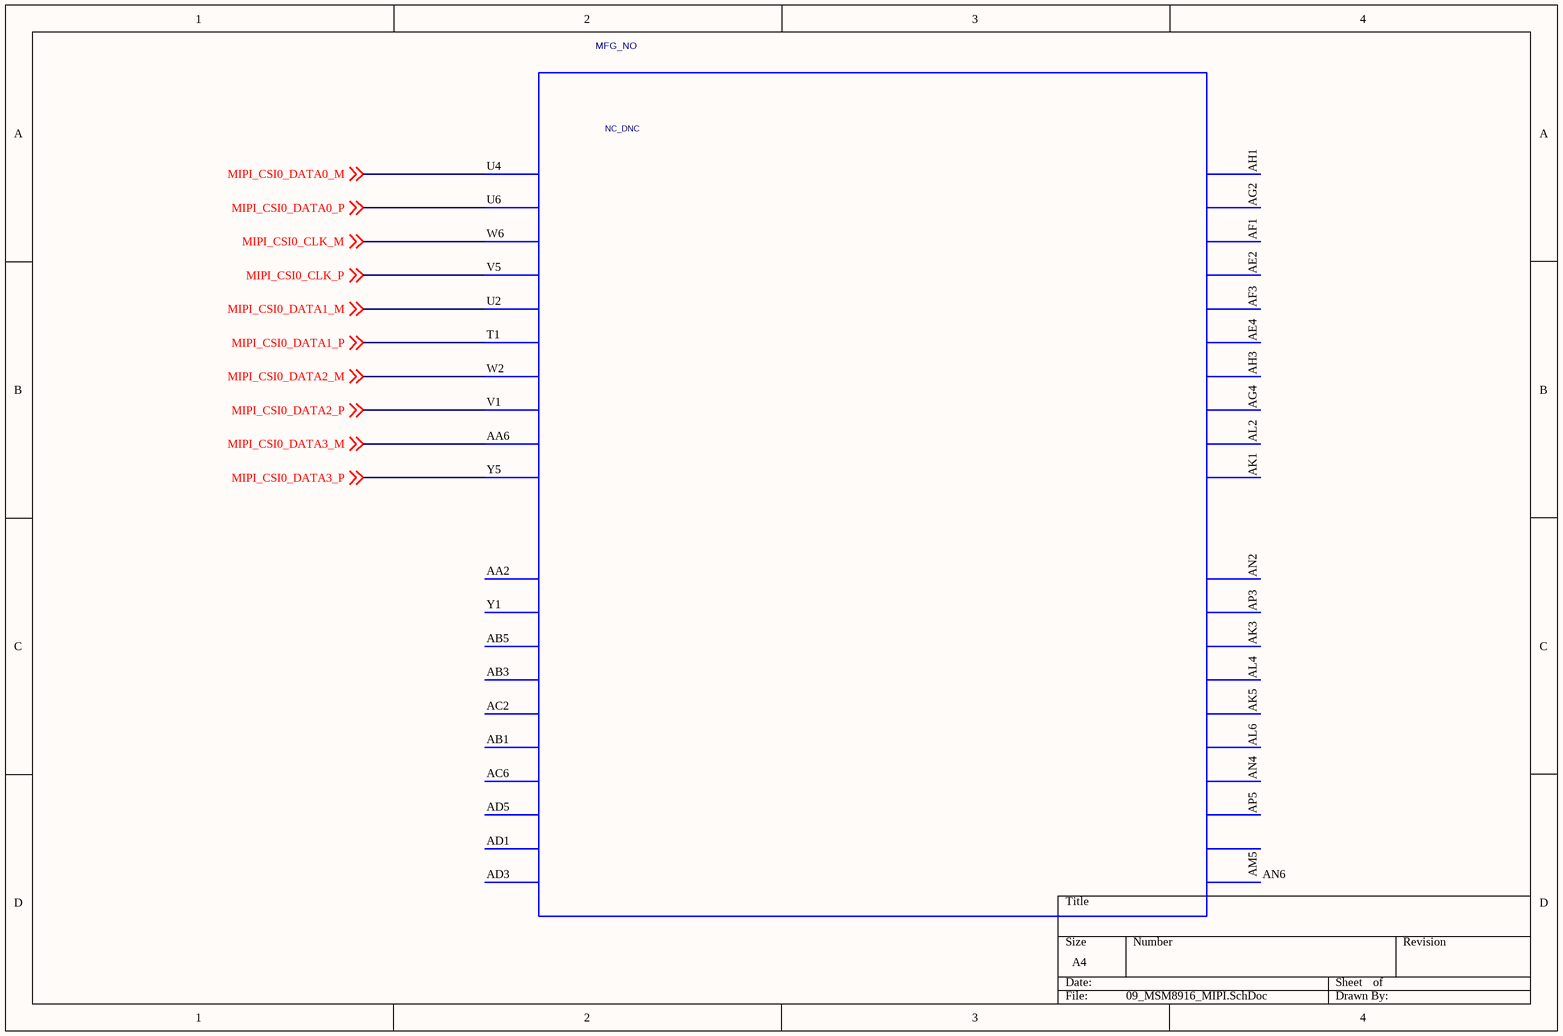
[diagram p14: 09_MSM8916_MIPI.SchDoc]

### Parts
U1  SYMNAME: NC_DNC  PART_ID: MFG_NO  [MSM-8916-0-760NSP-TR-00-0]  (hidden comment: ASIC_MSM8936_760PIN)  (part E of 13)

### Nets
MIPI_CSI0_CLK_M: U1.W6(MIPI_CSI0_LANE1N) ; off-sheet MIPI_CSI0_CLK_M
MIPI_CSI0_CLK_P: U1.V5(MIPI_CSI0_LANE1P) ; off-sheet MIPI_CSI0_CLK_P
MIPI_CSI0_DATA0_M: U1.U4(MIPI_CSI0_LANE0N) ; off-sheet MIPI_CSI0_DATA0_M
MIPI_CSI0_DATA0_P: U1.U6(MIPI_CSI0_LANE0P) ; off-sheet MIPI_CSI0_DATA0_P
MIPI_CSI0_DATA1_M: U1.U2(MIPI_CSI0_LANE2N) ; off-sheet MIPI_CSI0_DATA1_M
MIPI_CSI0_DATA1_P: U1.T1(MIPI_CSI0_LANE2P) ; off-sheet MIPI_CSI0_DATA1_P
MIPI_CSI0_DATA2_M: U1.W2(MIPI_CSI0_LANE3N) ; off-sheet MIPI_CSI0_DATA2_M
MIPI_CSI0_DATA2_P: U1.V1(MIPI_CSI0_LANE3P) ; off-sheet MIPI_CSI0_DATA2_P
MIPI_CSI0_DATA3_M: U1.AA6(MIPI_CSI0_LANE4N) ; off-sheet MIPI_CSI0_DATA3_M
MIPI_CSI0_DATA3_P: U1.Y5(MIPI_CSI0_LANE4P) ; off-sheet MIPI_CSI0_DATA3_P

Not connected (* = marked no-connect by the designer): U1 AA2(MIPI_CSI1_LANE0N) AB1(MIPI_CSI1_LANE2P) AB3(MIPI_CSI1_LANE1P) AB5(MIPI_CSI1_LANE1N) AC2(MIPI_CSI1_LANE2N) AC6(MIPI_CSI1_LANE3N) AD1(MIPI_CSI1_LANE4N) AD3(MIPI_CSI1_LANE4P) AD5(MIPI_CSI1_LANE3P) AE2(MIPI_DSI0_LANE0P) AE4(MIPI_DSI0_LANE1P) AF1(MIPI_DSI0_LANE0N) AF3(MIPI_DSI0_LANE1N) AG2(MIPI_DSI0_CLKP) AG4(MIPI_DSI0_LANE2P) AH1(MIPI_DSI0_CLKN) AH3(MIPI_DSI0_LANE2N) AK1(MIPI_DSI0_LANE3P) AK3(MIPI_DSI1_LANE0N) AK5(MIPI_DSI1_LANE1N) AL2(MIPI_DSI0_LANE3N) AL4(MIPI_DSI1_LANE0P) AL6(MIPI_DSI1_LANE1P) AM5(MIPI_DSI1_LANE3N) AN2(MIPI_DSI1_CLKN) AN4(MIPI_DSI1_LANE2N) AN6(MIPI_DSI1_LANE3P) AP3(MIPI_DSI1_CLKP) AP5(MIPI_DSI1_LANE2P) Y1(MIPI_CSI1_LANE0P)

### Library data of the parts
U1 = ASIC_MSM8936_760PIN: as U1 on sheet 06_MSM8916_EBIO LPDDR3; PACK_TYPE: ?

## Sheet 11 MSM8916_POWER2.SchDoc
size 871 x 579 mm
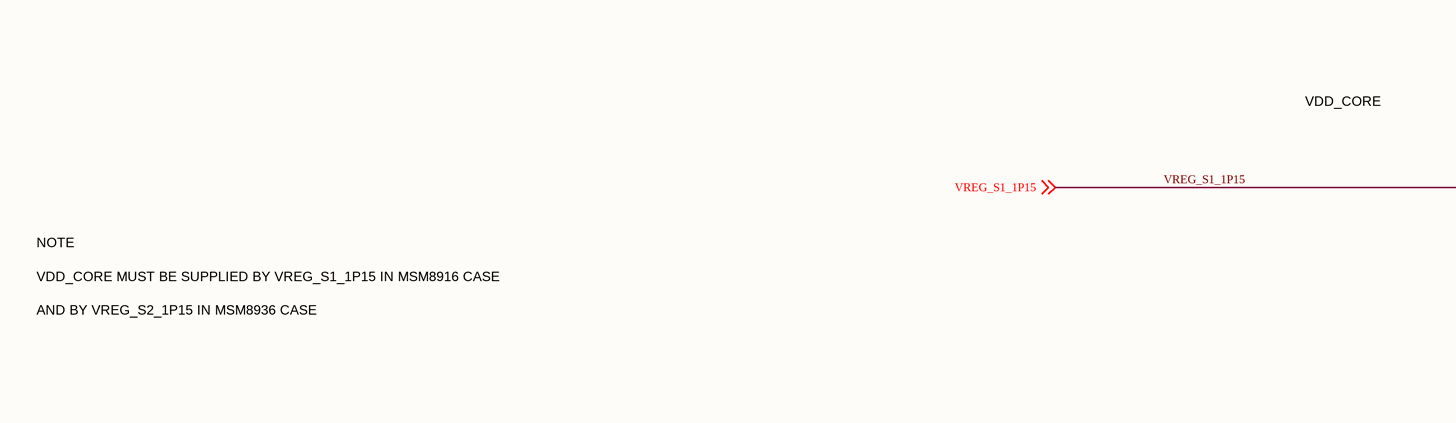
[diagram p15: 11 MSM8916_POWER2.SchDoc, top left]
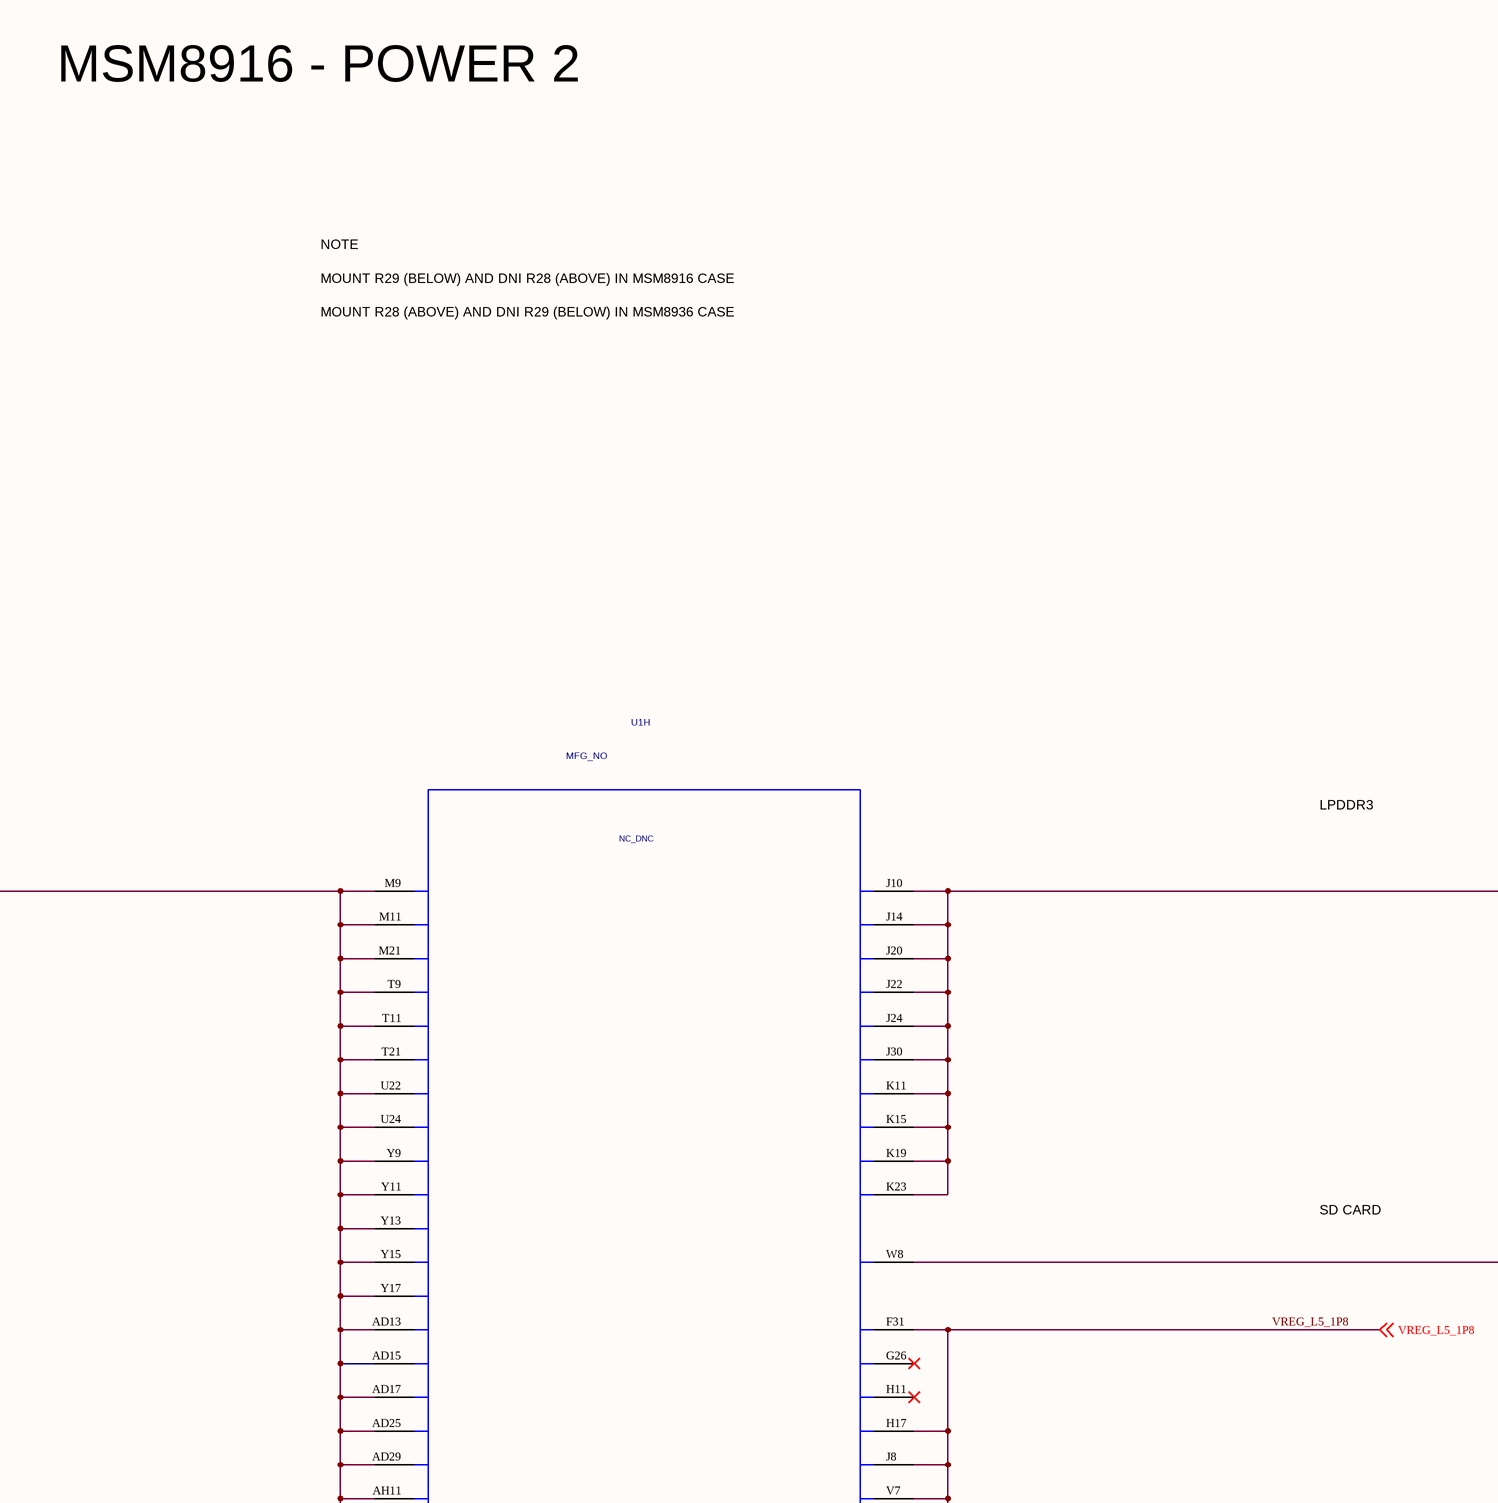
[diagram p16: 11 MSM8916_POWER2.SchDoc, top middle]
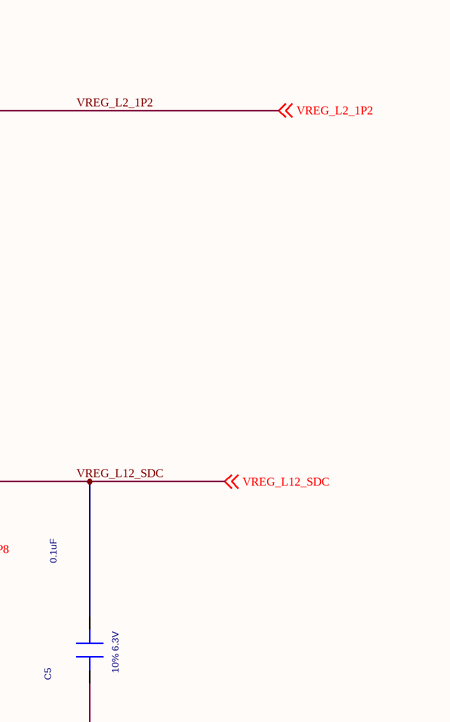
[diagram p17: 11 MSM8916_POWER2.SchDoc, top right]
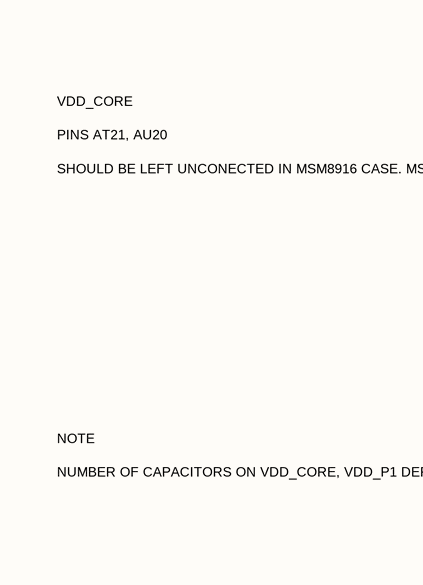
[diagram p18: 11 MSM8916_POWER2.SchDoc, bottom left]
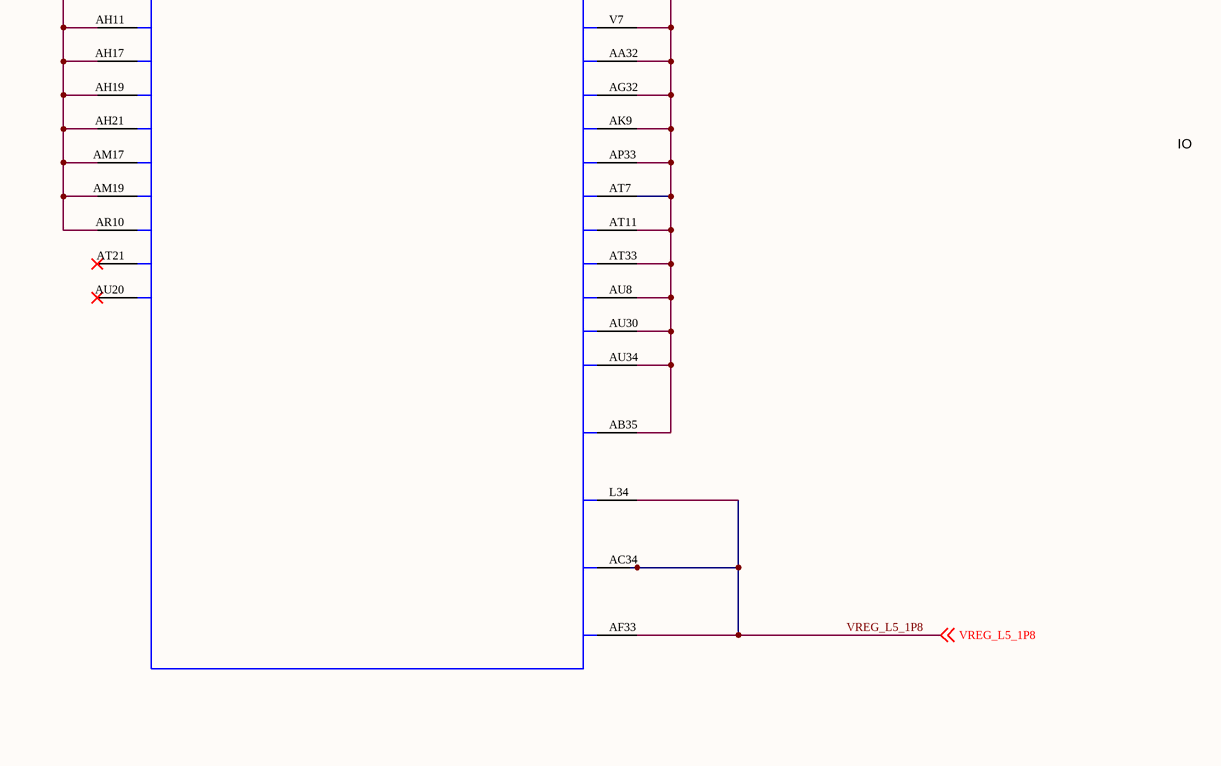
[diagram p19: 11 MSM8916_POWER2.SchDoc, bottom middle]
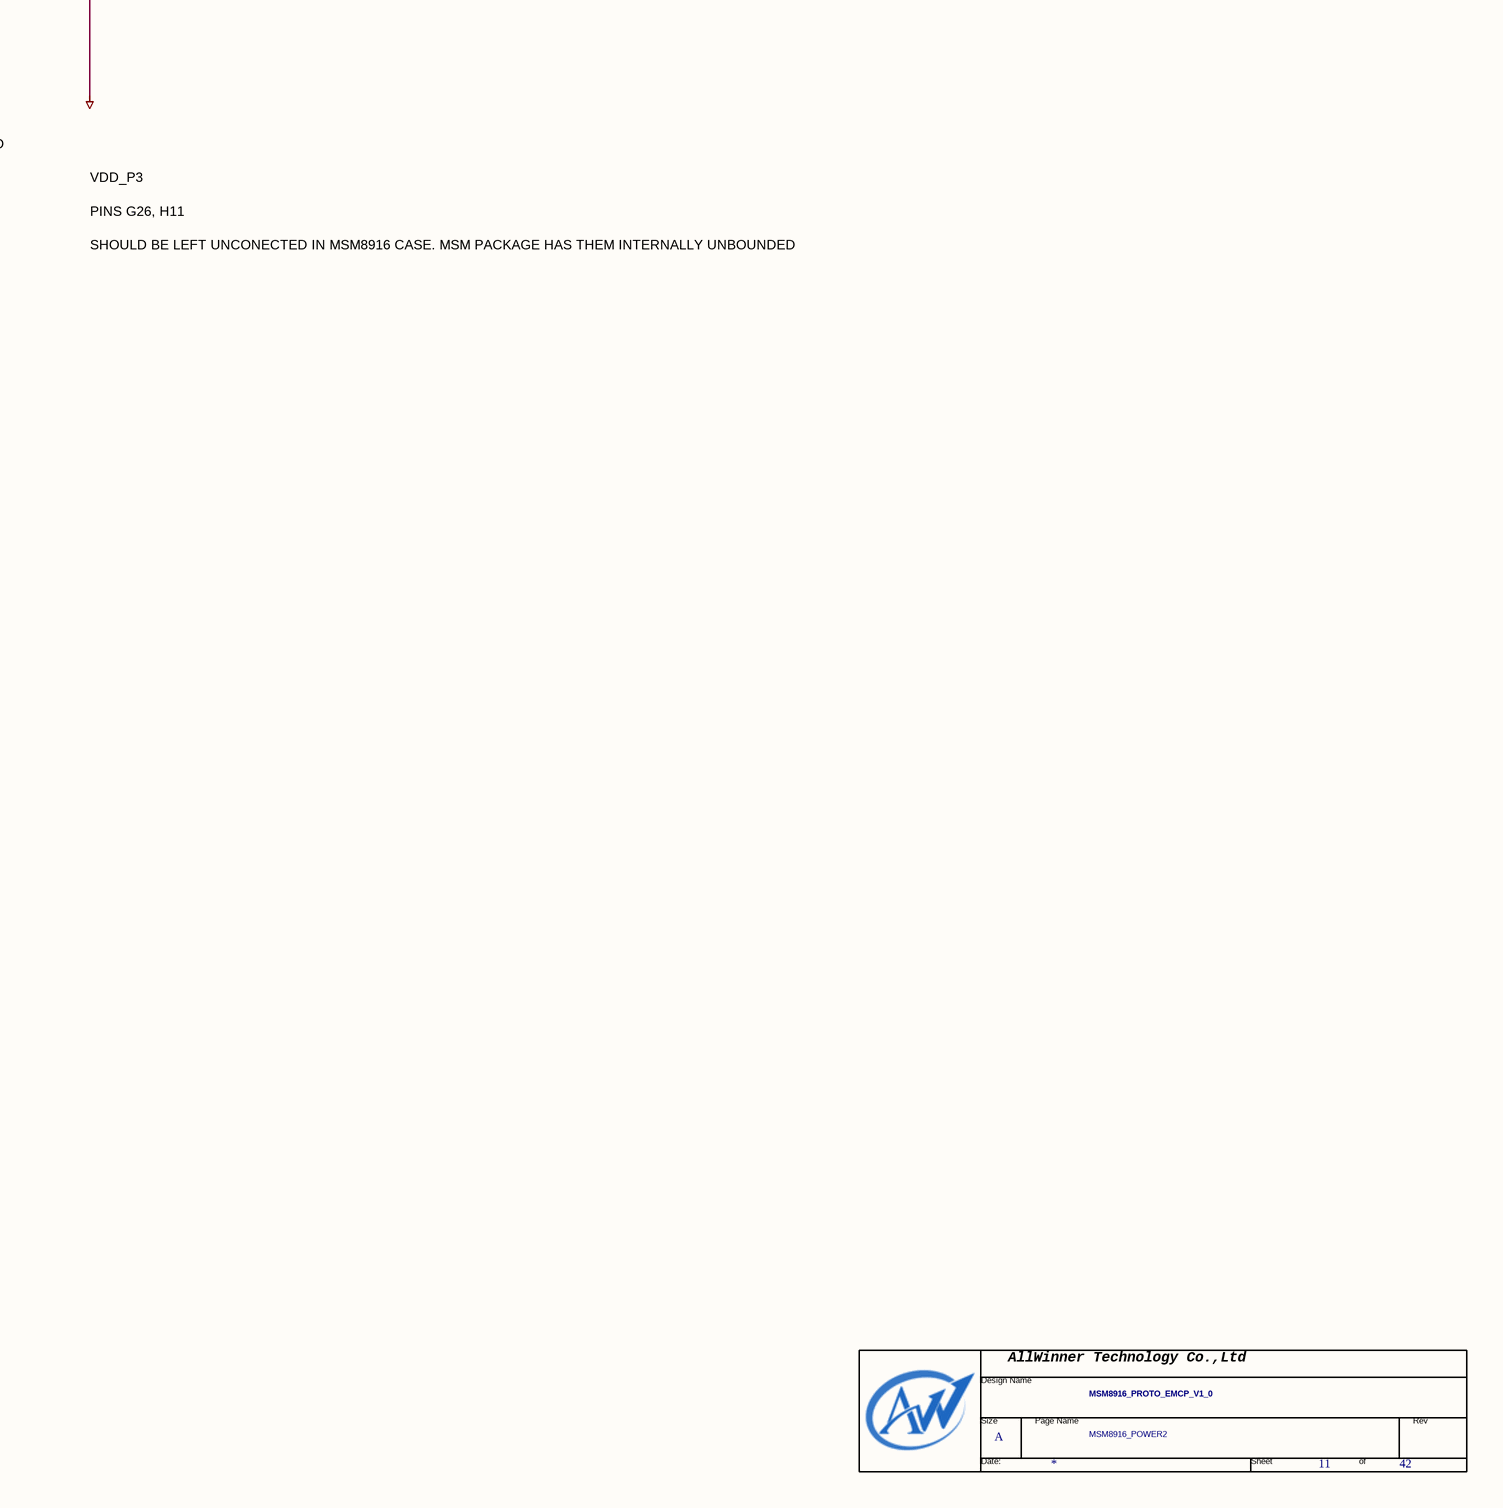
[diagram p20: 11 MSM8916_POWER2.SchDoc, bottom right]

### Parts
(Parts that share a designator on the sheet are numbered #1, #2 ... from top to bottom, then left to right.)
*#3  Page Count: 42  Page Number: 11  Page Size: A  Title: MSM8916_PROTO_EMCP_V1_0  Doc: MSM8916_POWER2  (hidden comment: TitleBlock0-AW)  (graphical)
C5  0.1uF  Tolerance: 10% 6.3V  [c0402]
U1  SYMNAME: NC_DNC  PART_ID: MFG_NO  [MSM-8916-0-760NSP-TR-00-0]  (hidden comment: ASIC_MSM8936_760PIN)  (part H of 13)

### Nets
DGND: C5.1(POS)
VREG_L2_1P2: U1.J10(VDDPX_1_1) U1.J14(VDDPX_1_2) U1.J20(VDDPX_1_3) U1.J22(VDDPX_1_4) U1.J24(VDDPX_1_5) U1.J30(VDDPX_1_6) U1.K11(VDDPX_1_7) U1.K15(VDDPX_1_8) U1.K19(VDDPX_1_9) U1.K23(VDDPX_1_10) ; off-sheet VREG_L2_1P2
VREG_L5_1P8: U1.AA32(VDDPX_3_7) U1.AB35(VDDPX_4) U1.AC34(VDDPX_6) U1.AF33(VDDPX_7) U1.AG32(VDDPX_3_8) U1.AK9(VDDPX_3_9) U1.AP33(VDDPX_3_10) U1.AT7(VDDPX_3_11) U1.AT11(VDDPX_3_12) U1.AT33(VDDPX_3_13) U1.AU8(VDDPX_3_14) U1.AU30(VDDPX_3_15) U1.AU34(VDDPX_3_16) U1.F31(VDDPX_3_1) U1.H17(VDDPX_3_4) U1.J8(VDDPX_3_5) U1.L34(VDDPX_5) U1.V7(VDDPX_3_6) ; off-sheet VREG_L5_1P8
VREG_L12_SDC: C5.2(NEG) U1.W8(VDDPX_2) ; off-sheet VREG_L12_SDC
VREG_S1_1P15: U1.AD13(VDDCX_1_14) U1.AD15(VDDCX_1_15) U1.AD17(VDDCX_1_16) U1.AD25(VDDCX_1_17) U1.AD29(VDDCX_1_18) U1.AH11(VDDCX_1_19) U1.AH17(VDDCX_1_20) U1.AH19(VDDCX_1_21) U1.AH21(VDDCX_1_22) U1.AM17(VDDCX_1_23) U1.AM19(VDDCX_1_24) U1.AR10(VDDCX_1_25) U1.M9(VDDCX_1_1) U1.M11(VDDCX_1_2) U1.M21(VDDCX_1_3) U1.T9(VDDCX_1_4) U1.T11(VDDCX_1_5) U1.T21(VDDCX_1_6) U1.U22(VDDCX_1_7) U1.U24(VDDCX_1_8) U1.Y9(VDDCX_1_9) U1.Y11(VDDCX_1_10) U1.Y13(VDDCX_1_11) U1.Y15(VDDCX_1_12) U1.Y17(VDDCX_1_13) ; off-sheet VREG_S1_1P15

Not connected (* = marked no-connect by the designer): U1 AT21(VDDCX_1_26)* AU20(VDDCX_1_27)* G26(VDDPX_3_2)* H11(VDDPX_3_3)*

### Notes on the sheet
- MSM8916 - POWER 2
- MOUNT R29 (BELOW) AND DNI R28 (ABOVE) IN MSM8916 CASE
- NOTE
- MOUNT R28 (ABOVE) AND DNI R29 (BELOW) IN MSM8936 CASE
- VDD_CORE
- LPDDR3
- VDD_CORE MUST BE SUPPLIED BY VREG_S1_1P15 IN MSM8916 CASE
- AND BY VREG_S2_1P15 IN MSM8936 CASE
- SD CARD
- IO
- PINS G26, H11
- VDD_P3
- PINS AT21, AU20
- SHOULD BE LEFT UNCONECTED IN MSM8916 CASE. MSM PACKAGE HAS THEM INTERNALLY UNBOUNDED
- NUMBER OF CAPACITORS ON VDD_CORE, VDD_P1 DEPENDS ON PDN RESULTS
- (in symbol TitleBlock0-AW) AllWinner Technology Co.,Ltd; Design Name; Size; Page Name; Rev; Date:; Sheet; of

### Library data of the parts
C5 = CAP#1: PART_NUMBER: MCN_NO; PART_ID: MFG_NO; OriginalSymbolOrigin: (-75,50); VOLT: ?V; SYMNAME: CAP; CDS_LMAN_SYM_OUTLINE: -25,50,25,-50; PACK_TYPE: ?
U1 = ASIC_MSM8936_760PIN: as U1 on sheet 06_MSM8916_EBIO LPDDR3; PACK_TYPE: ?
*#3 = TitleBlock0-AW: RevCode: ?; Page Create Date: March  8, 1995; Page Modify Date: *